# Altium project ODrive_2motor.PrjPcb
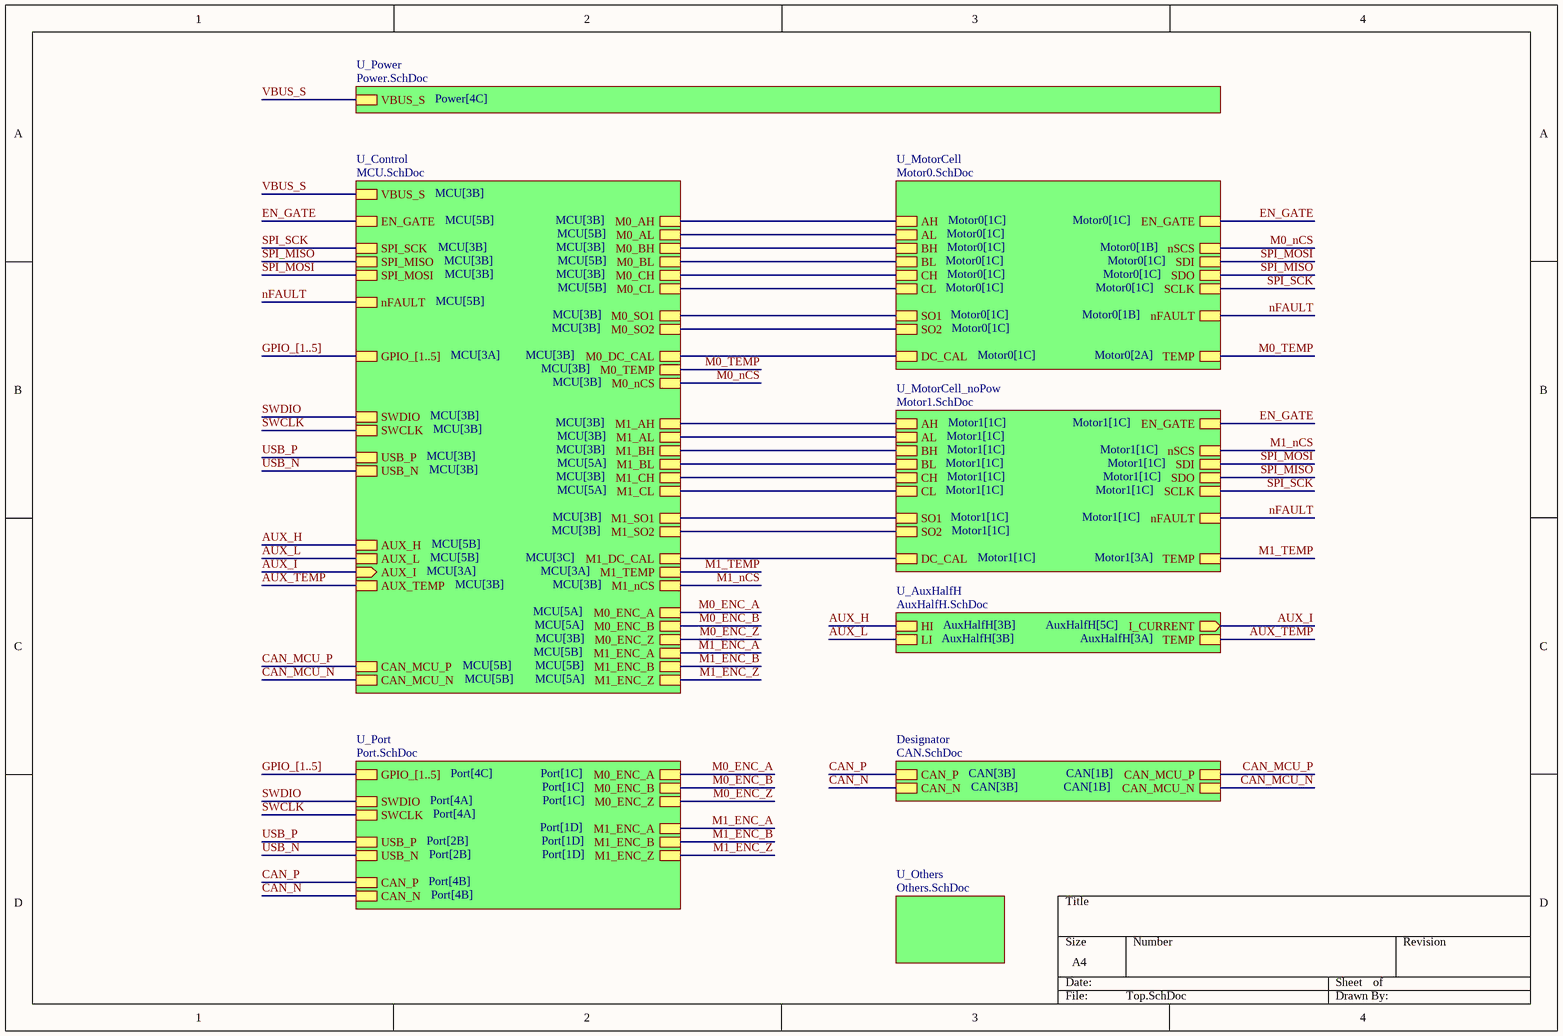
[diagram p0: Top.SchDoc]
9 sheets, 198 parts. Net scope: hierarchical (ports join the sheet entries above them; power ports are global).
Board file: Odrive.PcbDoc
Sheets:
  Top.SchDoc
    U_AuxHalfH = AuxHalfH.SchDoc
    U_Control = MCU.SchDoc
    U_MotorCell = Motor0.SchDoc
    U_MotorCell_noPow = Motor1.SchDoc
    U_Power = Power.SchDoc
    U_Port = Port.SchDoc
    Designator = CAN.SchDoc
    U_Others = Others.SchDoc

## Sheet Top.SchDoc
size A4

### Sub-sheets
Designator = CAN.SchDoc: CAN_P, CAN_N, CAN_MCU_P, CAN_MCU_N
U_AuxHalfH = AuxHalfH.SchDoc: HI, LI, I_CURRENT (out), TEMP
U_Control = MCU.SchDoc: VBUS_S, M1_AL, M0_AH, M0_BH, M0_CH, M0_SO1, M0_SO2, M1_SO2, M1_SO1, AUX_TEMP, M0_TEMP, M1_AH, M1_BH, M1_CH, M0_DC_CAL, M1_BL, M1_CL, EN_GATE, AUX_L, AUX_H, M0_AL, M0_BL, M0_CL, nFAULT, M1_DC_CAL, M0_nCS, M1_nCS, AUX_I (in), M1_TEMP, SPI_SCK, SPI_MISO, SPI_MOSI, GPIO_[1..5], SWDIO, SWCLK, USB_N, USB_P, M1_ENC_Z, M0_ENC_A, M0_ENC_B, M1_ENC_A, M1_ENC_B, M0_ENC_Z, CAN_MCU_P, CAN_MCU_N
U_MotorCell = Motor0.SchDoc: nFAULT, EN_GATE, AH, AL, BH, BL, CH, CL, DC_CAL, SDI, SDO, SCLK, nSCS, SO1, SO2, TEMP
U_MotorCell_noPow = Motor1.SchDoc: nFAULT, EN_GATE, AH, AL, BH, BL, CH, CL, DC_CAL, SDI, SDO, SCLK, nSCS, TEMP, SO1, SO2
U_Others = Others.SchDoc: no entries
U_Port = Port.SchDoc: GPIO_[1..5], SWDIO, SWCLK, CAN_P, CAN_N, M1_ENC_A, M1_ENC_B, M1_ENC_Z, M0_ENC_A, M0_ENC_B, M0_ENC_Z, USB_N, USB_P
U_Power = Power.SchDoc: VBUS_S

### Nets
AUX_H: sheet U_AuxHalfH/HI, sheet U_Control/AUX_H
AUX_I: sheet U_AuxHalfH/I_CURRENT, sheet U_Control/AUX_I
AUX_L: sheet U_AuxHalfH/LI, sheet U_Control/AUX_L
AUX_TEMP: sheet U_AuxHalfH/TEMP, sheet U_Control/AUX_TEMP
CAN_MCU_N: sheet U_Control/CAN_MCU_N, sheet Designator/CAN_MCU_N
CAN_MCU_P: sheet U_Control/CAN_MCU_P, sheet Designator/CAN_MCU_P
CAN_N: sheet U_Port/CAN_N, sheet Designator/CAN_N
CAN_P: sheet U_Port/CAN_P, sheet Designator/CAN_P
EN_GATE: sheet U_Control/EN_GATE, sheet U_MotorCell/EN_GATE, sheet U_MotorCell_noPow/EN_GATE
M0_ENC_A: sheet U_Control/M0_ENC_A, sheet U_Port/M0_ENC_A
M0_ENC_B: sheet U_Control/M0_ENC_B, sheet U_Port/M0_ENC_B
M0_ENC_Z: sheet U_Control/M0_ENC_Z, sheet U_Port/M0_ENC_Z
M0_nCS: sheet U_Control/M0_nCS, sheet U_MotorCell/nSCS
M0_TEMP: sheet U_Control/M0_TEMP, sheet U_MotorCell/TEMP
M1_ENC_A: sheet U_Control/M1_ENC_A, sheet U_Port/M1_ENC_A
M1_ENC_B: sheet U_Control/M1_ENC_B, sheet U_Port/M1_ENC_B
M1_ENC_Z: sheet U_Control/M1_ENC_Z, sheet U_Port/M1_ENC_Z
M1_nCS: sheet U_Control/M1_nCS, sheet U_MotorCell_noPow/nSCS
M1_TEMP: sheet U_Control/M1_TEMP, sheet U_MotorCell_noPow/TEMP
nFAULT: sheet U_Control/nFAULT, sheet U_MotorCell/nFAULT, sheet U_MotorCell_noPow/nFAULT
SPI_MISO: sheet U_Control/SPI_MISO, sheet U_MotorCell/SDO, sheet U_MotorCell_noPow/SDO
SPI_MOSI: sheet U_Control/SPI_MOSI, sheet U_MotorCell/SDI, sheet U_MotorCell_noPow/SDI
SPI_SCK: sheet U_Control/SPI_SCK, sheet U_MotorCell/SCLK, sheet U_MotorCell_noPow/SCLK
SWCLK: sheet U_Control/SWCLK, sheet U_Port/SWCLK
SWDIO: sheet U_Control/SWDIO, sheet U_Port/SWDIO
USB_N: sheet U_Control/USB_N, sheet U_Port/USB_N
USB_P: sheet U_Control/USB_P, sheet U_Port/USB_P
VBUS_S: sheet U_Control/VBUS_S, sheet U_Power/VBUS_S
NetC47_2: sheet U_Control/M0_SO1, sheet U_MotorCell/SO1
NetC48_2: sheet U_Control/M0_SO2, sheet U_MotorCell/SO2
NetC62_2: sheet U_Control/M1_SO1, sheet U_MotorCell_noPow/SO1
NetC63_2: sheet U_Control/M1_SO2, sheet U_MotorCell_noPow/SO2
NetU4_4: sheet U_Control/M1_DC_CAL, sheet U_MotorCell_noPow/DC_CAL
NetU4_23: sheet U_Control/M1_AL, sheet U_MotorCell_noPow/AL
NetU4_26: sheet U_Control/M1_BL, sheet U_MotorCell_noPow/BL
NetU4_27: sheet U_Control/M1_CL, sheet U_MotorCell_noPow/CL
NetU4_34: sheet U_Control/M0_AL, sheet U_MotorCell/AL
NetU4_35: sheet U_Control/M0_BL, sheet U_MotorCell/BL
NetU4_36: sheet U_Control/M0_CL, sheet U_MotorCell/CL
NetU4_37: sheet U_Control/M1_AH, sheet U_MotorCell_noPow/AH
NetU4_38: sheet U_Control/M1_BH, sheet U_MotorCell_noPow/BH
NetU4_39: sheet U_Control/M1_CH, sheet U_MotorCell_noPow/CH
NetU4_40: sheet U_Control/M0_DC_CAL, sheet U_MotorCell/DC_CAL
NetU4_41: sheet U_Control/M0_AH, sheet U_MotorCell/AH
NetU4_42: sheet U_Control/M0_BH, sheet U_MotorCell/BH
NetU4_43: sheet U_Control/M0_CH, sheet U_MotorCell/CH

### Buses and harness runs
bus GPIO_[1..5] = sheet U_Control/GPIO_[1..5]
bus GPIO_[1..5] = sheet U_Port/GPIO_[1..5]

## Sheet AuxHalfH.SchDoc
size A3; DocumentNumber: 5; SheetNumber: 5; SheetTotal: 5
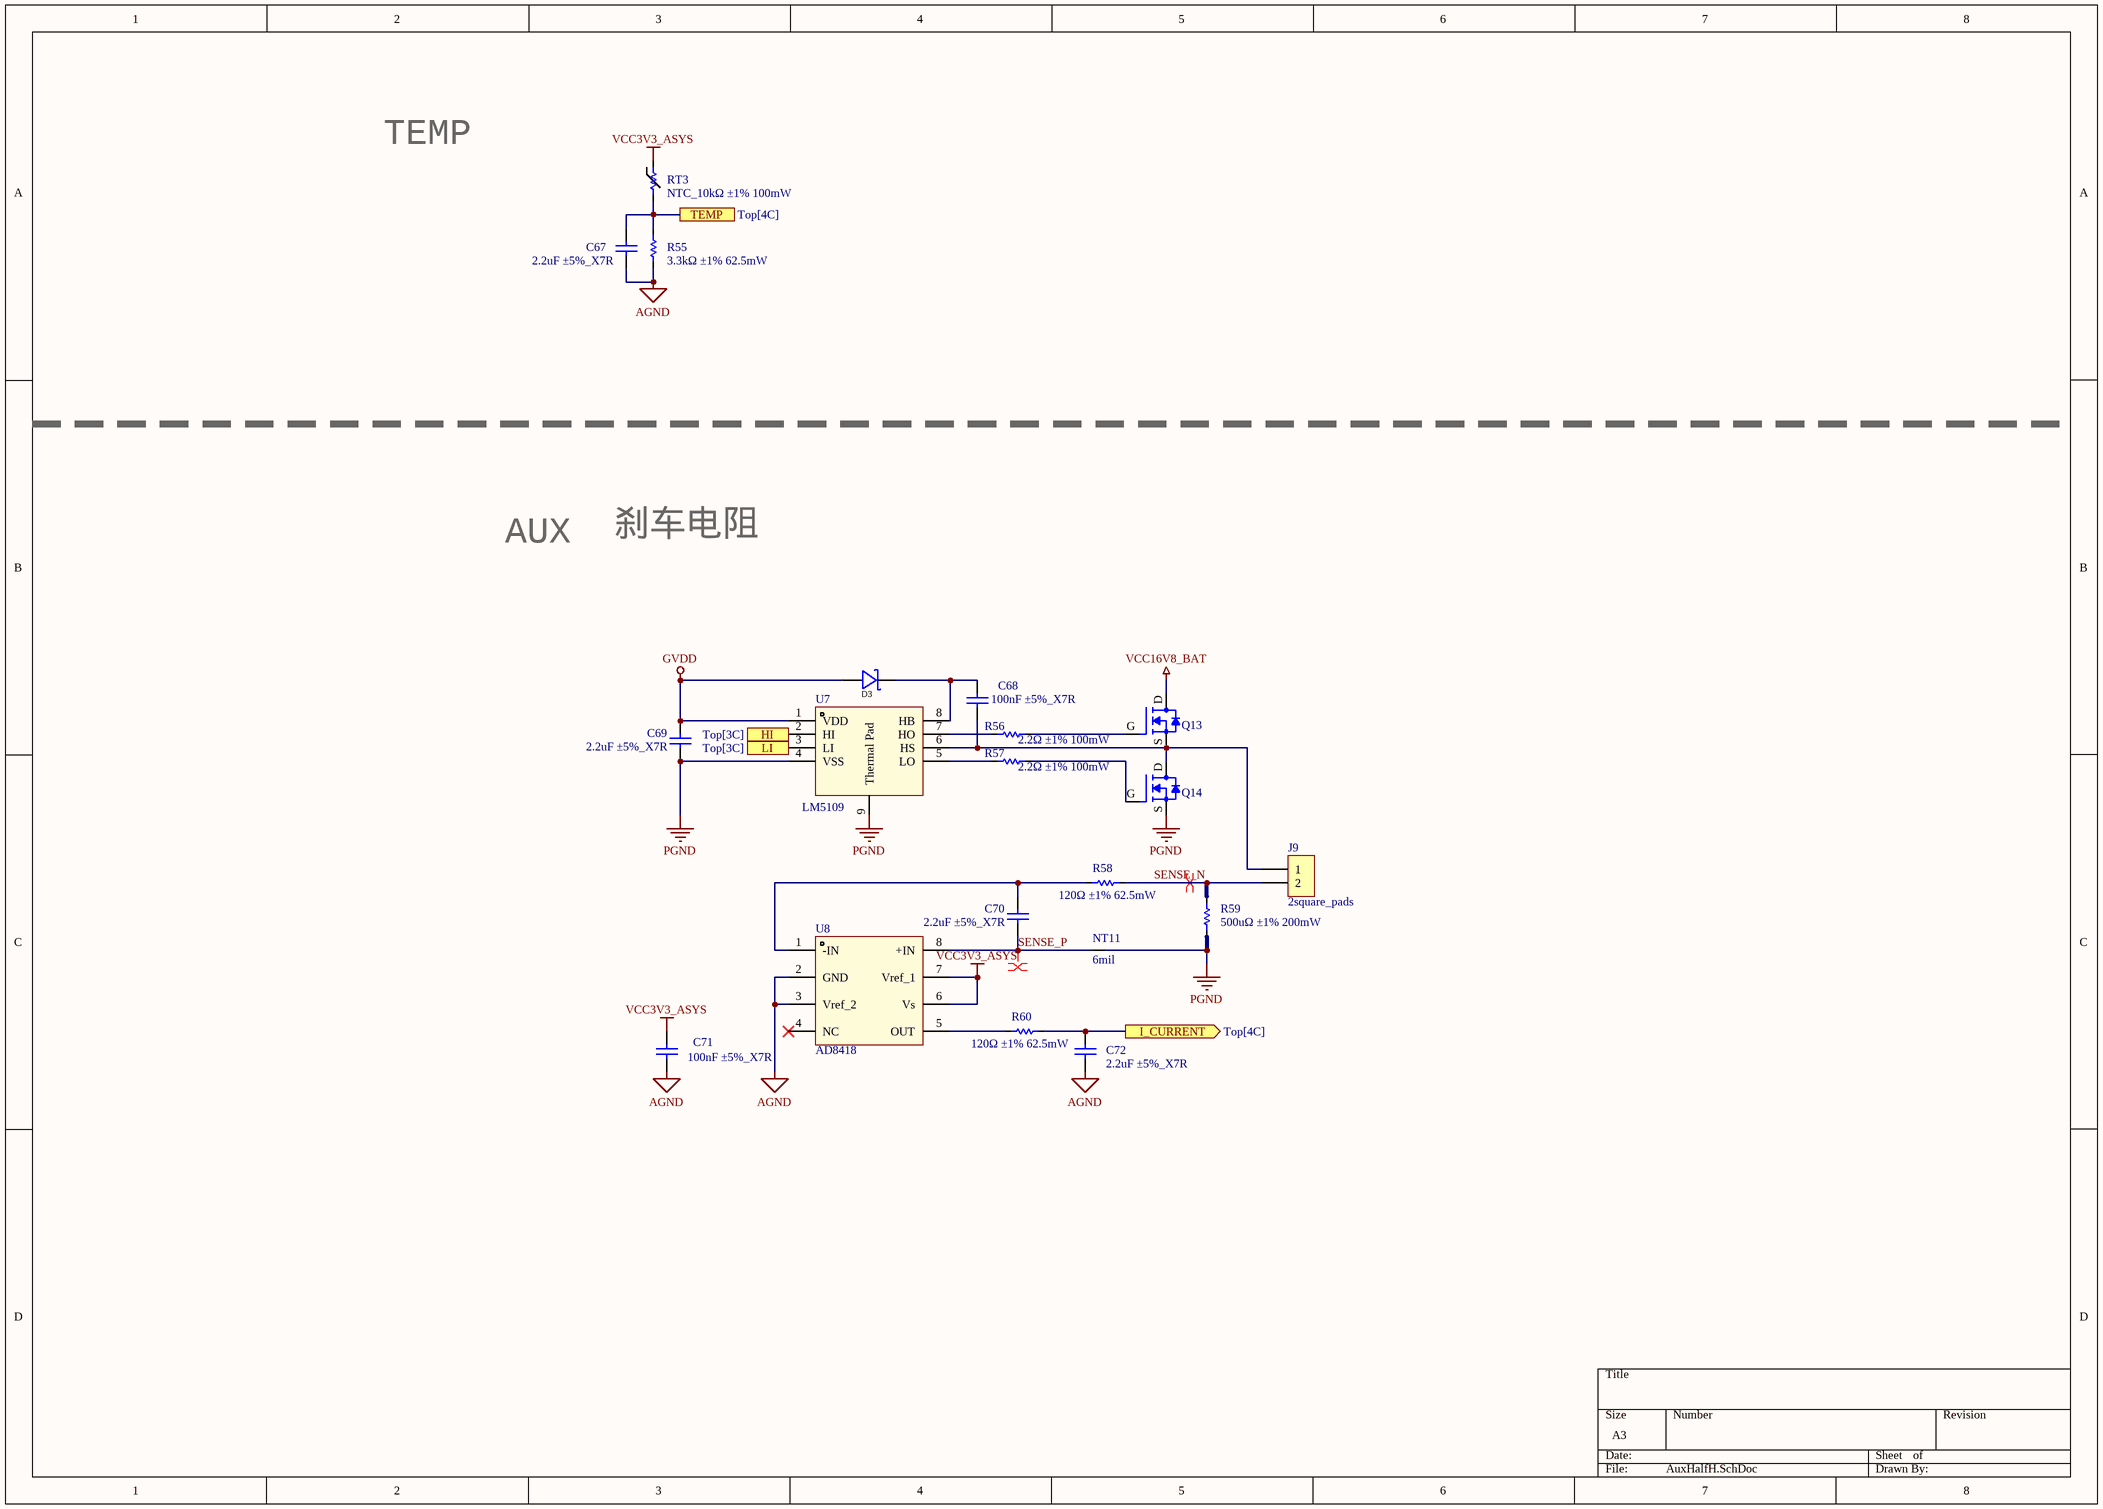
[diagram p1: AuxHalfH.SchDoc]

### Parts
C67  2.2uF ±5%_X7R  [WCAP-CSGP_0402_L1W0.5H0.5]
C68  100nF ±5%_X7R  [WCAP-CSGP_0603_L1.6W0.8H0.8_Reflow]
C69  2.2uF ±5%_X7R  [WCAP-CSGP_0603_L1.6W0.8H0.8_Reflow]
C70  2.2uF ±5%_X7R  [WCAP-CSGP_0402_L1W0.5H0.5]
C71  100nF ±5%_X7R  [WCAP-CSGP_0402_L1W0.5H0.5]
C72  2.2uF ±5%_X7R  [WCAP-CSGP_0402_L1W0.5H0.5]
D3  B340A-13-F  [SMA_L4.4-W2.6-LS5.0-RD]  (value not drawn)
J9  2square_pads  [2pads_square]
NT11  6mil  [NETTIE_6mil]  (net tie, no BOM)
Q13  BSC027N04LSG  [NRVTS10100EMFST1G]  (value not drawn)
Q14  BSC027N04LSG  [NRVTS10100EMFST1G]  (value not drawn)
R55  3.3kΩ ±1% 62.5mW  [WRIS-KSKE_0402]
R56  2.2Ω ±1% 100mW  [WRIS-KSKE_0402]
R57  2.2Ω ±1% 100mW  [WRIS-KSKE_0402]
R58  120Ω ±1% 62.5mW  [WRIS-KSKE_0402]
R59  500uΩ ±1% 200mW  [WRIS-KSKE_2512]
R60  120Ω ±1% 62.5mW  [WRIS-KSKE_0402]
RT3  NTC_10kΩ ±1% 100mW  [WRIS-KSKE_0402]
U7  LM5109  [SON80P400X80_HS-9N]
U8  AD8418  [MSOP-8_L3.0-W3.0-P0.65-LS5.0-BL]

### Ports
HI (see Top[3C]), I_CURRENT (out, see Top[4C]), LI (see Top[3C]), TEMP (see Top[4C])

### Nets
AGND: C67.1 C71.1 C72.1 R55.1 U8.2(GND) U8.3(Vref_2)
GVDD: C69.2 D3.2(A) U7.1(VDD)
PGND: C69.1 NT11.1 Q14.S R59.2 U7.4(VSS) U7.9(Thermal_Pad)
VCC3V3_ASYS: C71.2 RT3.1 U8.6(Vs) U8.7(Vref_1)
VCC16V8_BAT: Q13.D
AUX_H: U7.2(HI) ; port HI
AUX_I: C72.2 R60.1 ; port I_CURRENT
AUX_L: U7.3(LI) ; port LI
AUX_TEMP: C67.2 R55.2 RT3.2 ; port TEMP
SENSE_N: J9.2 R58.1 R59.1
SENSE_P: C70.1 NT11.2 U8.8(+IN)
NetC68_1: C68.1 J9.1 Q13.S Q14.D U7.6(HS)
NetC68_2: C68.2 D3.1(K) U7.8(HB)
NetC70_2: C70.2 R58.2 U8.1(-IN)
NetQ13_G: Q13.G R56.1
NetQ14_G: Q14.G R57.1
NetR56_2: R56.2 U7.7(HO)
NetR57_2: R57.2 U7.5(LO)
NetR60_2: R60.2 U8.5(OUT)

Not connected (* = marked no-connect by the designer): U8 4(NC)*

### Layout directives
differential pair: SENSE_N, SENSE_P

### Notes on the sheet
- TEMP
- AUX
- 刹车电阻

### Library data of the parts
C67-C72 = Cap: Capacitor; Published: 8-Jun-2000; LatestRevisionDate: 17-Jul-2002; LatestRevisionNote: Re-released for DXP Platform.; PackageReference: RAD-0.3; Publisher: Altium Limited; PackageDescription: Radial Cap, Thru-Hole; 2 Leads; 0.3 in Pin Spacing
D3 = Diode_Schottky: 直流反向耐压(Vr):40V;平均整流电流(Io):3A;正向压降(Vf):500mV@3A;; Manufacturer: DIODES(美台); Add into BOM: yes; Reverse Voltage (Vr): 40V; Average Rectified Current (Io): 3A; Name: B340A-13-F; Symbol: B340A-13-F; Device: B340A-13-F; LCSC Part Name: 40V 3A 500mV@3A; Supplier Part: C85098; Manufacturer Part: B340A-13-F; Supplier Footprint: SMA(DO-214AC); JLCPCB Part Class: 扩展库; Datasheet: https://atta.szlcsc.com/upload/public/pdf/source/20171023/C134454_15087453575121052549.pdf; Supplier: LCSC; Convert to PCB: yes; Forward Voltage (Vf@If): 500mV@3A
NT11 = NETTIE
Q13 Q14 = MOSFET-N: MOSFET – Power, Single, / N-Channel, PG-TDSON-8 / SuperSO8 5x6 / 40 V, 139 A; Manufacturer: ON Semiconductor; Manufacturer Part Number: NTMFS4935NT1G; Drain to Source Voltage (Vdss): 30V; Current - Continuous Drain (Id) @ 25°C: 13A (Ta), 93A (Tc); Drive Voltage (Max Rds On,  Min Rds On): 4.5V, 10V; Vgs(th) (Max) @ Id: 2.2V @ 250µA; Gate Charge (Qg) (Max) @ Vgs: 49.4nC @ 10V; Input Capacitance (Ciss) (Max) @ Vds: 4850pF @ 15V; Vgs (Max): ±20V; Power Dissipation (Max): 930mW (Ta), 48W (Tc); Rds On (Max) @ Id, Vgs: 3.2 mOhm @ 30A, 10V; Supplier 1: Digi-Key; Supplier Part Number 1: NTMFS4935NT1GOSCT-ND; RoHS: RoHS Compliant; Category: Discrete Semiconductor Products; Stock 1: 932; Pricing 1: 1=0.61, 10=0.541, 100=0.4145, 500=0.3277 (USD); Packaging: Cut Tape (CT); Part Status: Active; FET Type: N-Channel; Technology: MOSFET (Metal Oxide); FET Feature: -; Operating Temperature: -55°C ~ 150°C (TJ); Mounting Type: Surface Mount; Supplier Device Package: 5-DFN (5x6) (8-SOFL); Package / Case: 8-PowerTDFN, 5 Leads; ComponentLink1URL: http://www.onsemi.com/pub_link/Collateral/NTMFS4935N-D.PDF; ComponentLink1Description: http://www.onsemi.com/pub_link/Collateral/NTMFS4935N-D.PDF
R55-R60 = Res: Resistor; Published: 8-Jun-2000; LatestRevisionDate: 17-Jul-2002; LatestRevisionNote: Re-released for DXP Platform.; PackageReference: AXIAL-0.3; Publisher: Altium Limited; PackageDescription: Axial Device, Thru-Hole; 2 Leads; 0.3 in Pin Spacing
RT3 = TEMP RES: THERMISTOR 10K OHM NTC 0402 SMD
U7 = LM5109: DRIVER, MOSFET, HALF BRIDGE, WSON-8, 1A; Supplier 1: Farnell; Supplier Part Number 1: 2400642RL; Supplier 2: Farnell; Supplier Part Number 2: 2400642; Supplier 3: Farnell; Supplier Part Number 3: 2382850
U8 = AD8418WBRZ: ANALOG DEVICES Current Sense Amplifier, Bidirectional, 1, 130 µA, NSOIC

## Sheet MCU.SchDoc
size A3; DocumentNumber: 3; SheetNumber: 1; SheetTotal: 5
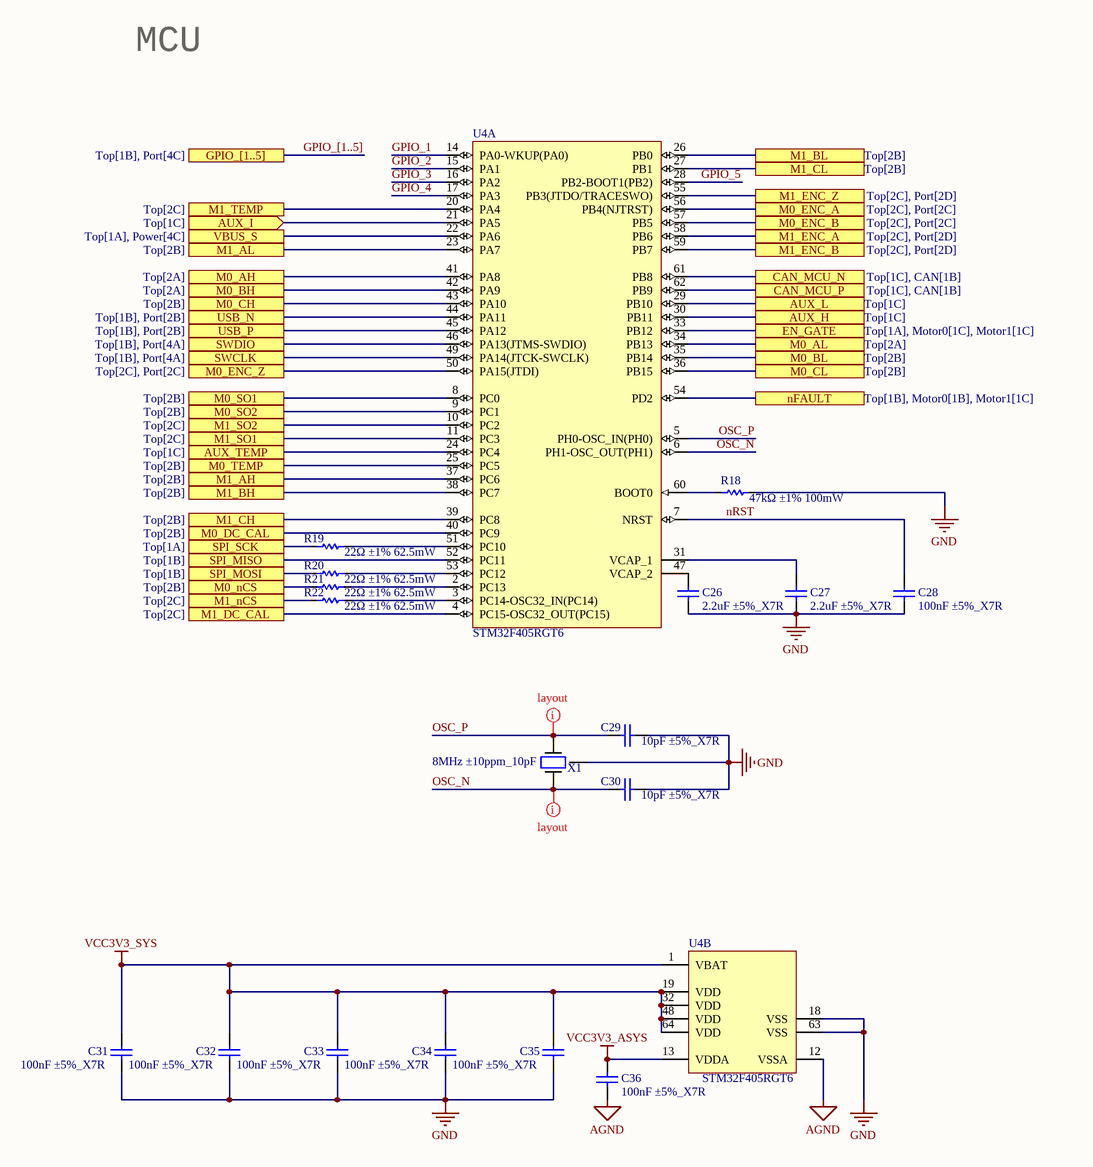
[diagram p2: MCU.SchDoc]

### Parts
C26  2.2uF ±5%_X7R  [WCAP-CSGP_0603_L1.6W0.8H0.8_Reflow]
C27  2.2uF ±5%_X7R  [WCAP-CSGP_0603_L1.6W0.8H0.8_Reflow]
C28  100nF ±5%_X7R  [WCAP-CSGP_0402_L1W0.5H0.5]
C29  10pF ±5%_X7R  [WCAP-CSGP_0402_L1W0.5H0.5]
C30  10pF ±5%_X7R  [WCAP-CSGP_0402_L1W0.5H0.5]
C31  100nF ±5%_X7R  [WCAP-CSGP_0402_L1W0.5H0.5]
C32  100nF ±5%_X7R  [WCAP-CSGP_0402_L1W0.5H0.5]
C33  100nF ±5%_X7R  [WCAP-CSGP_0402_L1W0.5H0.5]
C34  100nF ±5%_X7R  [WCAP-CSGP_0402_L1W0.5H0.5]
C35  100nF ±5%_X7R  [WCAP-CSGP_0402_L1W0.5H0.5]
C36  100nF ±5%_X7R  [WCAP-CSGP_0402_L1W0.5H0.5]
R18  47kΩ ±1% 100mW  [WRIS-KSKE_0402]
R19  22Ω ±1% 62.5mW  [WRIS-KSKE_0402]
R20  22Ω ±1% 62.5mW  [WRIS-KSKE_0402]
R21  22Ω ±1% 62.5mW  [WRIS-KSKE_0402]
R22  22Ω ±1% 62.5mW  [WRIS-KSKE_0402]
U4  STM32F405RGT6  [STM-LQFP64_N]  (parts A,B of 2)
X1  8MHz ±10ppm_10pF  [CRYSTAL_3225]

### Ports
AUX_H (see Top[1C]), AUX_I (in, see Top[1C]), AUX_L (see Top[1C]), AUX_TEMP (see Top[1C]), CAN_MCU_N (see Top[1C], CAN[1B]), CAN_MCU_P (see Top[1C], CAN[1B]), EN_GATE (see Top[1A], Motor0[1C], Motor1[1C]), GPIO_[1..5] (see Top[1B], Port[4C]), M0_AH (see Top[2A]), M0_AL (see Top[2A]), M0_BH (see Top[2A]), M0_BL (see Top[2B]), M0_CH (see Top[2B]), M0_CL (see Top[2B]), M0_DC_CAL (see Top[2B]), M0_ENC_A (see Top[2C], Port[2C]), M0_ENC_B (see Top[2C], Port[2C]), M0_ENC_Z (see Top[2C], Port[2C]), M0_nCS (see Top[2B]), M0_SO1 (see Top[2B]), M0_SO2 (see Top[2B]), M0_TEMP (see Top[2B]), M1_AH (see Top[2B]), M1_AL (see Top[2B]), M1_BH (see Top[2B]), M1_BL (see Top[2B]), M1_CH (see Top[2B]), M1_CL (see Top[2B]), M1_DC_CAL (see Top[2C]), M1_ENC_A (see Top[2C], Port[2D]), M1_ENC_B (see Top[2C], Port[2D]), M1_ENC_Z (see Top[2C], Port[2D]), M1_nCS (see Top[2C]), M1_SO1 (see Top[2C]), M1_SO2 (see Top[2C]), M1_TEMP (see Top[2C]), nFAULT (see Top[1B], Motor0[1B], Motor1[1C]), SPI_MISO (see Top[1B]), SPI_MOSI (see Top[1B]), SPI_SCK (see Top[1A]), SWCLK (see Top[1B], Port[4A]), SWDIO (see Top[1B], Port[4A]), USB_N (see Top[1B], Port[2B]), USB_P (see Top[1B], Port[2B]), VBUS_S (see Top[1A], Power[4C])

### Nets
AGND: C36.1 U4.12(VSSA)
GND: C26.1 C27.1 C28.1 C29.2 C30.2 C31.1 C32.1 C33.1 C34.1 C35.1 R18.2 U4.18(VSS) U4.63(VSS) X1.G
VCC3V3_ASYS: C36.2 U4.13(VDDA)
VCC3V3_SYS: C31.2 C32.2 C33.2 C34.2 C35.2 U4.1(VBAT) U4.19(VDD) U4.32(VDD) U4.48(VDD) U4.64(VDD)
AUX_H: U4.30(PB11) ; port AUX_H
AUX_I: U4.21(PA5) ; port AUX_I
AUX_L: U4.29(PB10) ; port AUX_L
AUX_TEMP: U4.24(PC4) ; port AUX_TEMP
CAN_MCU_N: U4.61(PB8) ; port CAN_MCU_N
CAN_MCU_P: U4.62(PB9) ; port CAN_MCU_P
EN_GATE: U4.33(PB12) ; port EN_GATE
GPIO_1: U4.14(PA0-WKUP(PA0))
GPIO_2: U4.15(PA1)
GPIO_3: U4.16(PA2)
GPIO_4: U4.17(PA3)
GPIO_5: U4.28(PB2-BOOT1(PB2))
M0_ENC_A: U4.56(PB4(NJTRST)) ; port M0_ENC_A
M0_ENC_B: U4.57(PB5) ; port M0_ENC_B
M0_ENC_Z: U4.50(PA15(JTDI)) ; port M0_ENC_Z
M0_nCS: R21.1 ; port M0_nCS
M0_TEMP: U4.25(PC5) ; port M0_TEMP
M1_ENC_A: U4.58(PB6) ; port M1_ENC_A
M1_ENC_B: U4.59(PB7) ; port M1_ENC_B
M1_ENC_Z: U4.55(PB3(JTDO/TRACESWO)) ; port M1_ENC_Z
M1_nCS: R22.1 ; port M1_nCS
M1_TEMP: U4.20(PA4) ; port M1_TEMP
nFAULT: U4.54(PD2) ; port nFAULT
nRST: C28.2 U4.7(NRST)
OSC_N: C30.1 U4.6(PH1-OSC_OUT(PH1)) X1.1
OSC_P: C29.1 U4.5(PH0-OSC_IN(PH0)) X1.3
SPI_MISO: U4.52(PC11) ; port SPI_MISO
SPI_MOSI: R20.1 ; port SPI_MOSI
SPI_SCK: R19.1 ; port SPI_SCK
SWCLK: U4.49(PA14(JTCK-SWCLK)) ; port SWCLK
SWDIO: U4.46(PA13(JTMS-SWDIO)) ; port SWDIO
USB_N: U4.44(PA11) ; port USB_N
USB_P: U4.45(PA12) ; port USB_P
VBUS_S: U4.22(PA6) ; port VBUS_S
NetC26_2: C26.2 U4.47(VCAP_2)
NetC27_2: C27.2 U4.31(VCAP_1)
NetC47_2: U4.8(PC0) ; port M0_SO1
NetC48_2: U4.9(PC1) ; port M0_SO2
NetC62_2: U4.11(PC3) ; port M1_SO1
NetC63_2: U4.10(PC2) ; port M1_SO2
NetR18_1: R18.1 U4.60(BOOT0)
NetR19_2: R19.2 U4.51(PC10)
NetR20_2: R20.2 U4.53(PC12)
NetR21_2: R21.2 U4.2(PC13)
NetR22_2: R22.2 U4.3(PC14-OSC32_IN(PC14))
NetU4_4: U4.4(PC15-OSC32_OUT(PC15)) ; port M1_DC_CAL
NetU4_23: U4.23(PA7) ; port M1_AL
NetU4_26: U4.26(PB0) ; port M1_BL
NetU4_27: U4.27(PB1) ; port M1_CL
NetU4_34: U4.34(PB13) ; port M0_AL
NetU4_35: U4.35(PB14) ; port M0_BL
NetU4_36: U4.36(PB15) ; port M0_CL
NetU4_37: U4.37(PC6) ; port M1_AH
NetU4_38: U4.38(PC7) ; port M1_BH
NetU4_39: U4.39(PC8) ; port M1_CH
NetU4_40: U4.40(PC9) ; port M0_DC_CAL
NetU4_41: U4.41(PA8) ; port M0_AH
NetU4_42: U4.42(PA9) ; port M0_BH
NetU4_43: U4.43(PA10) ; port M0_CH

### Buses and harness runs
bus GPIO_[1..5] = port GPIO_[1..5]

### Layout directives
mark named layout: OSC_N, OSC_P

### Notes on the sheet
- MCU

### Library data of the parts
C26-C36 = Cap: Capacitor; Published: 8-Jun-2000; LatestRevisionDate: 17-Jul-2002; LatestRevisionNote: Re-released for DXP Platform.; PackageReference: RAD-0.3; Publisher: Altium Limited; PackageDescription: Radial Cap, Thru-Hole; 2 Leads; 0.3 in Pin Spacing
R18-R22 = Res: Resistor; Published: 8-Jun-2000; LatestRevisionDate: 17-Jul-2002; LatestRevisionNote: Re-released for DXP Platform.; PackageReference: AXIAL-0.3; Publisher: Altium Limited; PackageDescription: Axial Device, Thru-Hole; 2 Leads; 0.3 in Pin Spacing
U4 = STM32F405RGT6: ARM Cortex-M4 32-bit MCU+FPU, 210 DMIPS, 1024 kB Flash, 192 kB Internal RAM, 51 I/Os, 64-pin LQFP, -40 to 85 degC, Tray; Manufacturer: STMicroelectronics; D/A Converter: 2x12-bit; FLASH Size (Prog) (kB): 1024; I/Os (High Current): 51; Internal RAM Size (kB): 192; Operating Frequency(F) (Processor speed) (MHz): 168; Supply Voltage(Vcc) max (V): 3.6; Supply Voltage(Vcc) min (V): 1.8; DatasheetVersion: Rev. 4; PackageVersion: Rev. 4, 06/2013; PackageReference: LQFP64; PackageDescription: 64-Pin Low Profile Quad Flat Package, 10 x 10 mm Body, 0.5 mm Pitch; Supplier 1: Digi-Key; Supplier Part Number 1: 497-11767-ND; Supplier 2: Farnell; Supplier Part Number 2: 2064363; Supplier 3: Newark; Supplier Part Number 3: 73T2329; Supplier 4: Mouser; Supplier Part Number 4: 511-STM32F405RGT6; Core: ARM Cortex-M4; Packing: Tray; Mounting Technology: Surface Mount; PartNumber: STM32F405RGT6; ComponentLink1Description: Manufacturer URL; ComponentLink1URL: http://www.st.com/web/en/home.html; ComponentLink2Description: Datasheet; ComponentLink2URL: http://www.st.com/st-web-ui/static/active/en/resource/technical/document/datasheet/DM00037051.pdf; ComponentLink3Description: Package Specification; ComponentLink3URL: http://www.st.com/st-web-ui/static/active/en/resource/technical/document/datasheet/DM00037051.pdf
X1 = CRYSTAL: Crystal 8MHz ±10ppm 10pF 200 Ohm -10°C ~ 60°C Surface Mount 4-SMD, No Lead (DFN, LCC); Manufacturer: Abracon LLC; Manufacturer Part Number: ABM3B-8.000MHZ-10-1-U-T; Operating Mode: Fundamental; Supplier 1: Digi-Key; Supplier Part Number 1: 535-9721-1-ND; RoHS: RoHS Compliant; Category: Crystals, Oscillators, Resonators; Stock: 35437; Pricing 1: 1=0.69, 10=0.578, 50=0.5198, 100=0.462, 500=0.4389 (USD); Packaging: Cut Tape (CT); Part Status: Active; Type: MHz Crystal; Frequency Stability: ±10ppm; Frequency Tolerance: ±10ppm; Load Capacitance: 10pF; Operating Temperature: -10°C ~ 60°C; Ratings: -; Mounting Type: Surface Mount; Package / Case: 4-SMD, No Lead; Size / Dimension: 0.197" L x 0.126" W (5.00mm x 3.20mm); Height - Seated (Max): 0.043" (1.10mm); ComponentLink1URL: http://www.abracon.com/Resonators/abm3b.pdf; ComponentLink1Description: http://www.abracon.com/Resonators/abm3b.pdf; Supplier 2: Digi-Key; Supplier Part Number 2: 535-9721-2-ND; Pricing 2: 1000=0.336, 3000=0.315, 5000=0.3045, 10000=0.294 (USD)

## Sheet Motor0.SchDoc
size A3; DocumentNumber: 1; SheetNumber: 3; SheetTotal: 5; SPICEModelCache: <root> / <DocumentId>HIQXUUEP</DocumentId> / </root>
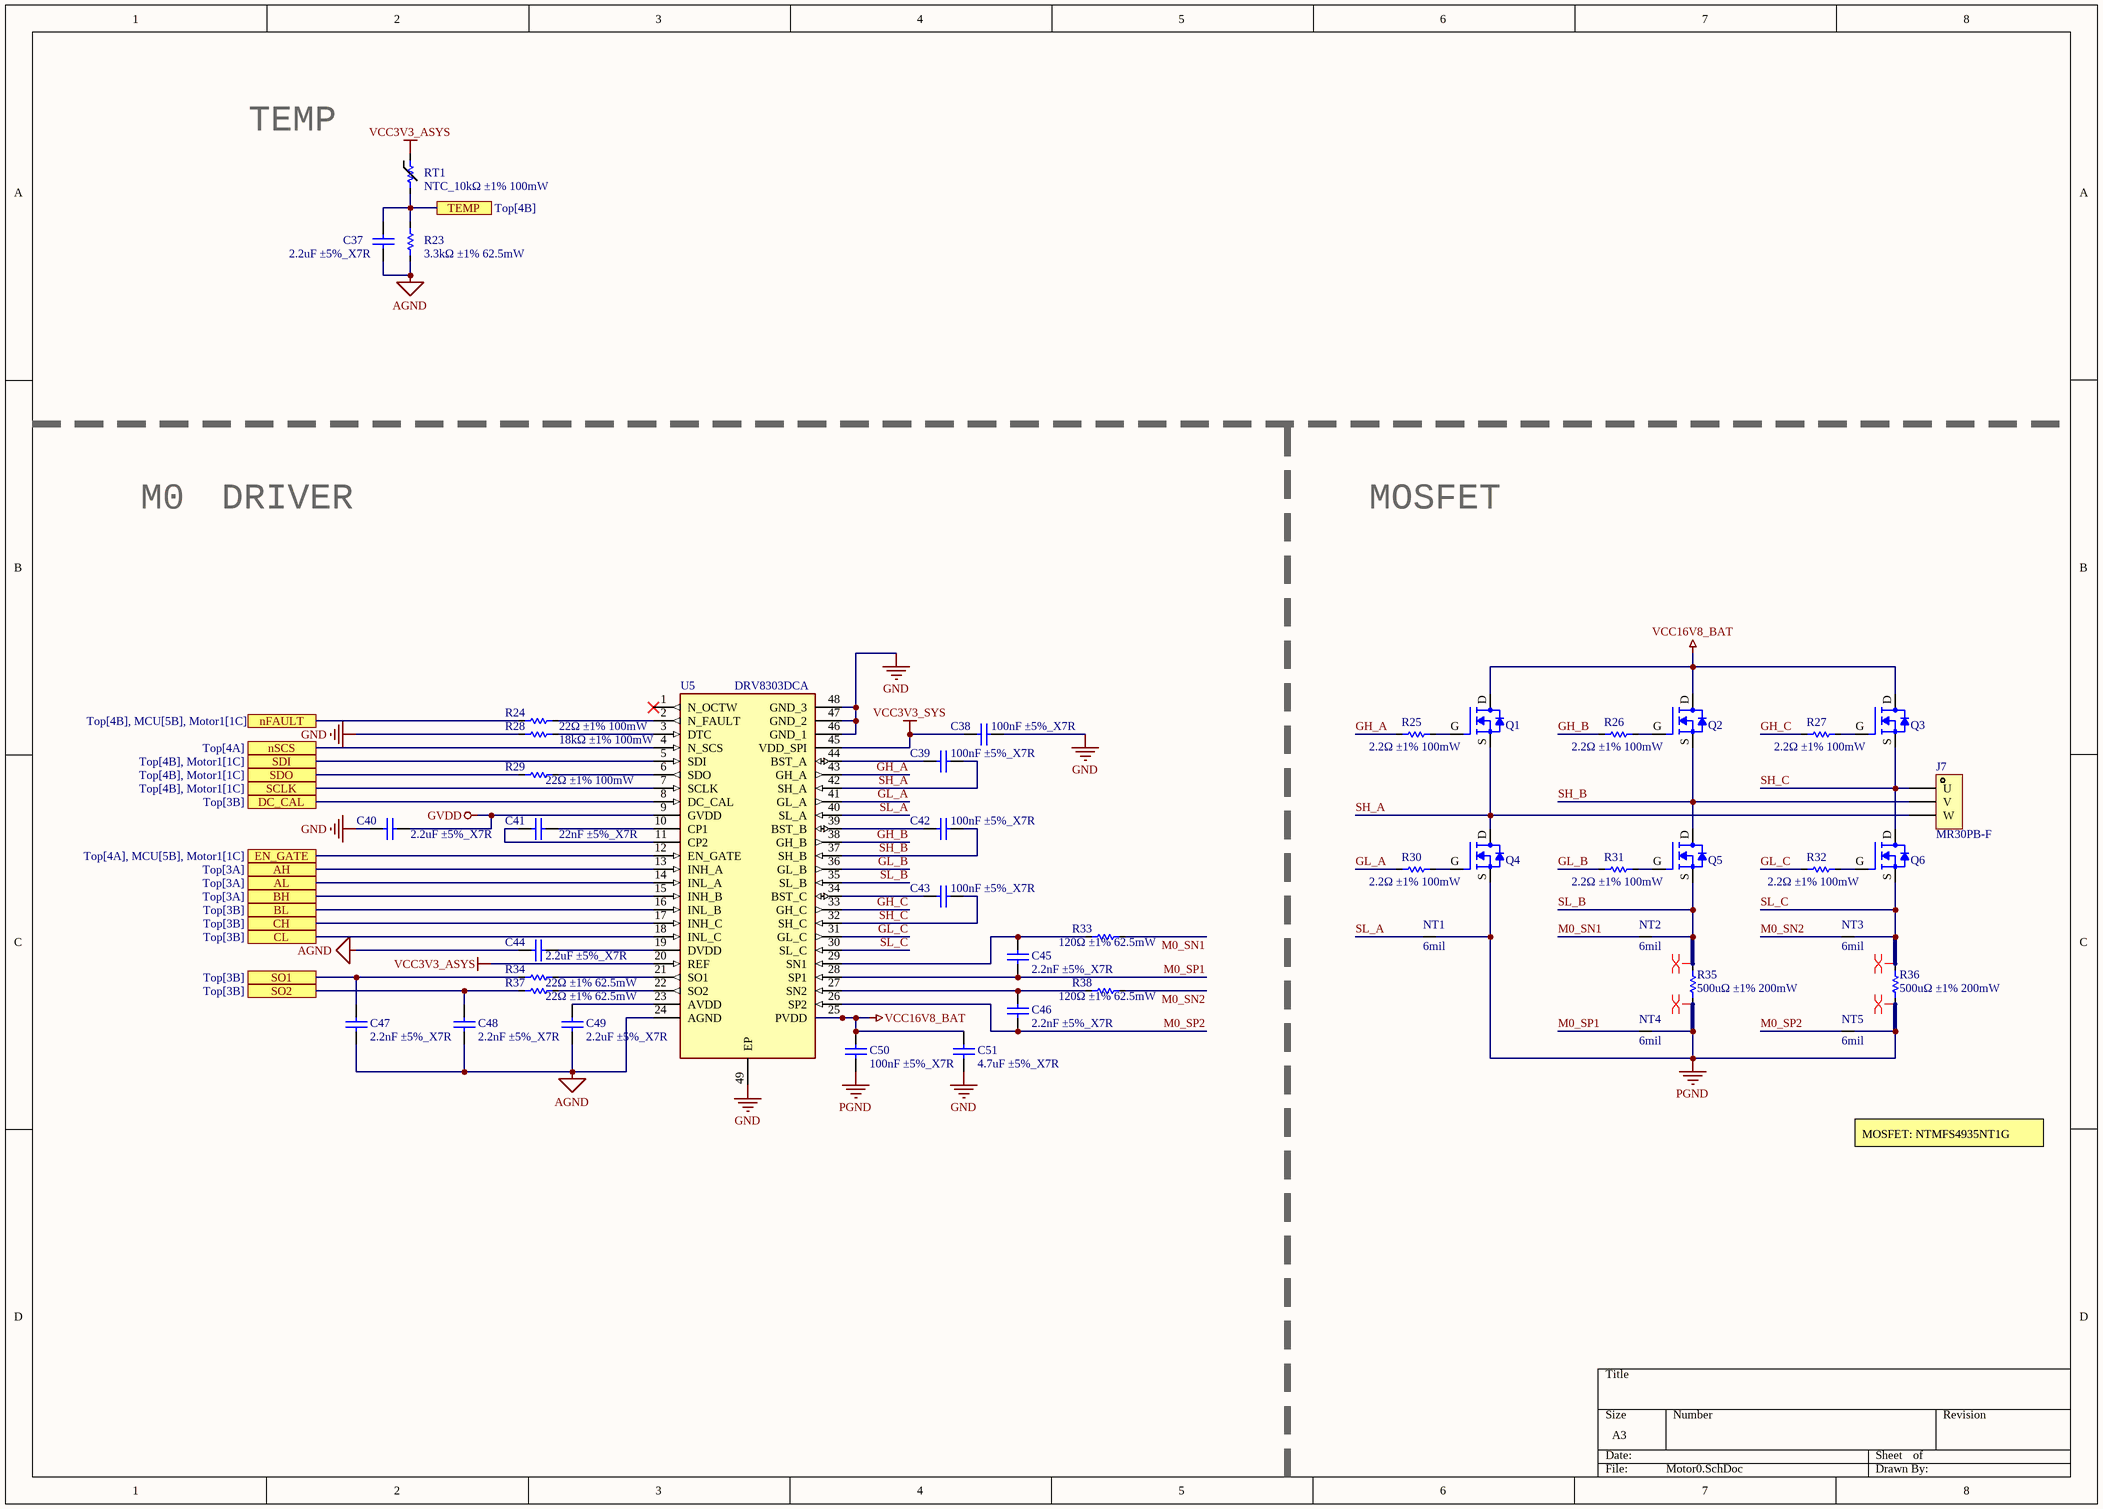
[diagram p3: Motor0.SchDoc]

### Parts
C37  2.2uF ±5%_X7R  [WCAP-CSGP_0402_L1W0.5H0.5]
C38  100nF ±5%_X7R  [WCAP-CSGP_0402_L1W0.5H0.5]
C39  100nF ±5%_X7R  [WCAP-CSGP_0402_L1W0.5H0.5]
C40  2.2uF ±5%_X7R  [WCAP-CSGP_0402_L1W0.5H0.5]
C41  22nF ±5%_X7R  [WCAP-CSGP_0402_L1W0.5H0.5]
C42  100nF ±5%_X7R  [WCAP-CSGP_0402_L1W0.5H0.5]
C43  100nF ±5%_X7R  [WCAP-CSGP_0402_L1W0.5H0.5]
C44  2.2uF ±5%_X7R  [WCAP-CSGP_0402_L1W0.5H0.5]
C45  2.2nF ±5%_X7R  [WCAP-CSGP_0402_L1W0.5H0.5]
C46  2.2nF ±5%_X7R  [WCAP-CSGP_0402_L1W0.5H0.5]
C47  2.2nF ±5%_X7R  [WCAP-CSGP_0402_L1W0.5H0.5]
C48  2.2nF ±5%_X7R  [WCAP-CSGP_0402_L1W0.5H0.5]
C49  2.2uF ±5%_X7R  [WCAP-CSGP_0402_L1W0.5H0.5]
C50  100nF ±5%_X7R  [WCAP-CSGP_0402_L1W0.5H0.5]
C51  4.7uF ±5%_X7R  [WCAP-CSGP_0603_L1.6W0.8H0.8_Reflow]
J7  MR30PB-F  [MR30PB-F [Straight] [SMT]]
NT1  6mil  [NETTIE_6mil]  (net tie, no BOM)
NT2  6mil  [NETTIE_6mil]  (net tie, no BOM)
NT3  6mil  [NETTIE_6mil]  (net tie, no BOM)
NT4  6mil  [NETTIE_6mil]  (net tie, no BOM)
NT5  6mil  [NETTIE_6mil]  (net tie, no BOM)
Q1  BSC027N04LSG  [NRVTS10100EMFST1G]  (value not drawn)
Q2  BSC027N04LSG  [NRVTS10100EMFST1G]  (value not drawn)
Q3  BSC027N04LSG  [NRVTS10100EMFST1G]  (value not drawn)
Q4  BSC027N04LSG  [NRVTS10100EMFST1G]  (value not drawn)
Q5  BSC027N04LSG  [NRVTS10100EMFST1G]  (value not drawn)
Q6  BSC027N04LSG  [NRVTS10100EMFST1G]  (value not drawn)
R23  3.3kΩ ±1% 62.5mW  [WRIS-KSKE_0402]
R24  22Ω ±1% 100mW  [WRIS-KSKE_0402]
R25  2.2Ω ±1% 100mW  [WRIS-KSKE_0402]
R26  2.2Ω ±1% 100mW  [WRIS-KSKE_0402]
R27  2.2Ω ±1% 100mW  [WRIS-KSKE_0402]
R28  18kΩ ±1% 100mW  [WRIS-KSKE_0402]
R29  22Ω ±1% 100mW  [WRIS-KSKE_0402]
R30  2.2Ω ±1% 100mW  [WRIS-KSKE_0402]
R31  2.2Ω ±1% 100mW  [WRIS-KSKE_0402]
R32  2.2Ω ±1% 100mW  [WRIS-KSKE_0402]
R33  120Ω ±1% 62.5mW  [WRIS-KSKE_0402]
R34  22Ω ±1% 62.5mW  [WRIS-KSKE_0402]
R35  500uΩ ±1% 200mW  [WRIS-KSKE_2512]
R36  500uΩ ±1% 200mW  [WRIS-KSKE_2512]
R37  22Ω ±1% 62.5mW  [WRIS-KSKE_0402]
R38  120Ω ±1% 62.5mW  [WRIS-KSKE_0402]
RT1  NTC_10kΩ ±1% 100mW  [WRIS-KSKE_0402]
U5  DRV8303DCA  [SOP50P810X120-49N]

### Ports
AH (see Top[3A]), AL (see Top[3A]), BH (see Top[3A]), BL (see Top[3B]), CH (see Top[3B]), CL (see Top[3B]), DC_CAL (see Top[3B]), EN_GATE (see Top[4A], MCU[5B], Motor1[1C]), nFAULT (see Top[4B], MCU[5B], Motor1[1C]), nSCS (see Top[4A]), SCLK (see Top[4B], Motor1[1C]), SDI (see Top[4B], Motor1[1C]), SDO (see Top[4B], Motor1[1C]), SO1 (see Top[3B]), SO2 (see Top[3B]), TEMP (see Top[4B])

### Nets
AGND: C37.1 C44.2 C47.1 C48.1 C49.1 R23.2 U5.24(AGND)
GND: C38.1 C40.1 C51.1 R28.2 U5.46(GND_1) U5.47(GND_2) U5.48(GND_3) U5.49(EP)
GVDD: C40.2 U5.9(GVDD)
PGND: C50.1 NT1.2 NT4.2 NT5.2 Q4.S R35.1 R36.1
VCC3V3_ASYS: RT1.1 U5.20(REF)
VCC3V3_SYS: C38.2 U5.45(VDD_SPI)
VCC16V8_BAT: C50.2 C51.2 Q1.D Q2.D Q3.D U5.25(PVDD)
EN_GATE: U5.12(EN_GATE) ; port EN_GATE
GH_A: R25.1 U5.43(GH_A)
GH_B: R26.1 U5.38(GH_B)
GH_C: R27.1 U5.33(GH_C)
GL_A: R30.1 U5.41(GL_A)
GL_B: R31.1 U5.36(GL_B)
GL_C: R32.1 U5.31(GL_C)
M0_nCS: U5.4(N_SCS) ; port nSCS
M0_SN1: NT2.1 R33.1
M0_SN2: NT3.1 R38.1
M0_SP1: C45.1 NT4.1 U5.28(SP1)
M0_SP2: C46.1 NT5.1 U5.26(SP2)
M0_TEMP: C37.2 R23.1 RT1.2 ; port TEMP
nFAULT: R24.1 ; port nFAULT
SH_A: C39.1 J7.3(W) Q1.S Q4.D U5.42(SH_A)
SH_B: C42.1 J7.2(V) Q2.S Q5.D U5.37(SH_B)
SH_C: C43.1 J7.1(U) Q3.S Q6.D U5.32(SH_C)
SL_A: NT1.1 U5.40(SL_A)
SL_B: NT2.2 Q5.S R35.2 U5.35(SL_B)
SL_C: NT3.2 Q6.S R36.2 U5.30(SL_C)
SPI_MISO: R29.1 ; port SDO
SPI_MOSI: U5.5(SDI) ; port SDI
SPI_SCK: U5.7(SCLK) ; port SCLK
NetC39_2: C39.2 U5.44(BST_A)
NetC41_1: C41.1 U5.10(CP1)
NetC41_2: C41.2 U5.11(CP2)
NetC42_2: C42.2 U5.39(BST_B)
NetC43_2: C43.2 U5.34(BST_C)
NetC44_1: C44.1 U5.19(DVDD)
NetC45_2: C45.2 R33.2 U5.29(SN1)
NetC46_2: C46.2 R38.2 U5.27(SN2)
NetC47_2: C47.2 R34.2 ; port SO1
NetC48_2: C48.2 R37.2 ; port SO2
NetC49_2: C49.2 U5.23(AVDD)
NetQ1_G: Q1.G R25.2
NetQ2_G: Q2.G R26.2
NetQ3_G: Q3.G R27.2
NetQ4_G: Q4.G R30.2
NetQ5_G: Q5.G R31.2
NetQ6_G: Q6.G R32.2
NetR24_2: R24.2 U5.2(N_FAULT)
NetR28_1: R28.1 U5.3(DTC)
NetR29_2: R29.2 U5.6(SDO)
NetR34_1: R34.1 U5.21(SO1)
NetR37_1: R37.1 U5.22(SO2)
NetU4_34: U5.14(INL_A) ; port AL
NetU4_35: U5.16(INL_B) ; port BL
NetU4_36: U5.18(INL_C) ; port CL
NetU4_40: U5.8(DC_CAL) ; port DC_CAL
NetU4_41: U5.13(INH_A) ; port AH
NetU4_42: U5.15(INH_B) ; port BH
NetU4_43: U5.17(INH_C) ; port CH

Not connected (* = marked no-connect by the designer): U5 1(N_OCTW)*

### Notes on the sheet
- TEMP
- M0
- DRIVER
- MOSFET
- MOSFET: NTMFS4935NT1G

### Library data of the parts
C37-C39 C41-C43 C45-C48 C50 C51 = Cap: Capacitor; Published: 8-Jun-2000; LatestRevisionDate: 17-Jul-2002; LatestRevisionNote: Re-released for DXP Platform.; PackageReference: RAD-0.3; Publisher: Altium Limited; PackageDescription: Radial Cap, Thru-Hole; 2 Leads; 0.3 in Pin Spacing
C40 C44 C49 = Cap: CL05A225KO5NQNC; Published: 8-Jun-2000; LatestRevisionDate: 17-Jul-2002; LatestRevisionNote: Re-released for DXP Platform.; PackageReference: RAD-0.3; Publisher: Altium Limited; PackageDescription: Radial Cap, Thru-Hole; 2 Leads; 0.3 in Pin Spacing
J7 = MR30PB-F [Straight] [SMT]: 驱动器端
NT1-NT5 = NETTIE
Q1-Q6 = MOSFET-N: as Q13 on sheet AuxHalfH; Supplier 1: Digi-Key; Supplier Part Number 1: NTMFS4935NT1GOSCT-ND; RoHS: RoHS Compliant; Category: Discrete Semiconductor Products; Stock 1: 932; Pricing 1: 1=0.61, 10=0.541, 100=0.4145, 500=0.3277 (USD); Packaging: Cut Tape (CT); Part Status: Active; FET Type: N-Channel; Technology: MOSFET (Metal Oxide); FET Feature: -; Operating Temperature: -55°C ~ 150°C (TJ); Mounting Type: Surface Mount; Supplier Device Package: 5-DFN (5x6) (8-SOFL); Package / Case: 8-PowerTDFN, 5 Leads; ComponentLink1URL: http://www.onsemi.com/pub_link/Collateral/NTMFS4935N-D.PDF; ComponentLink1Description: http://www.onsemi.com/pub_link/Collateral/NTMFS4935N-D.PDF
R23-R38 = Res: Resistor; Published: 8-Jun-2000; LatestRevisionDate: 17-Jul-2002; LatestRevisionNote: Re-released for DXP Platform.; PackageReference: AXIAL-0.3; Publisher: Altium Limited; PackageDescription: Axial Device, Thru-Hole; 2 Leads; 0.3 in Pin Spacing
RT1 = TEMP RES: THERMISTOR 10K OHM NTC 0402 SMD
U5 = DRV8303DCA: Integrated Circuit; Manufacturer_Name: Texas Instruments; Datasheet Link: https://componentsearchengine.com/Datasheets/2/DRV8303DCA.pdf; Height: 1.2mm; Manufacturer_Part_Number: DRV8303DCA; Mouser Part Number: 595-DRV8303DCA; Mouser Price/Stock: https://www.mouser.co.uk/ProductDetail/Texas-Instruments/DRV8303DCA?qs=igp4D3uu33KLowzNFy6WPA%3D%3D; Arrow Part Number: DRV8303DCA; Arrow Price/Stock: https://www.arrow.com/en/products/drv8303dca/texas-instruments

## Sheet Motor1.SchDoc
size A3; DocumentNumber: 2; SheetNumber: 4; SheetTotal: 5
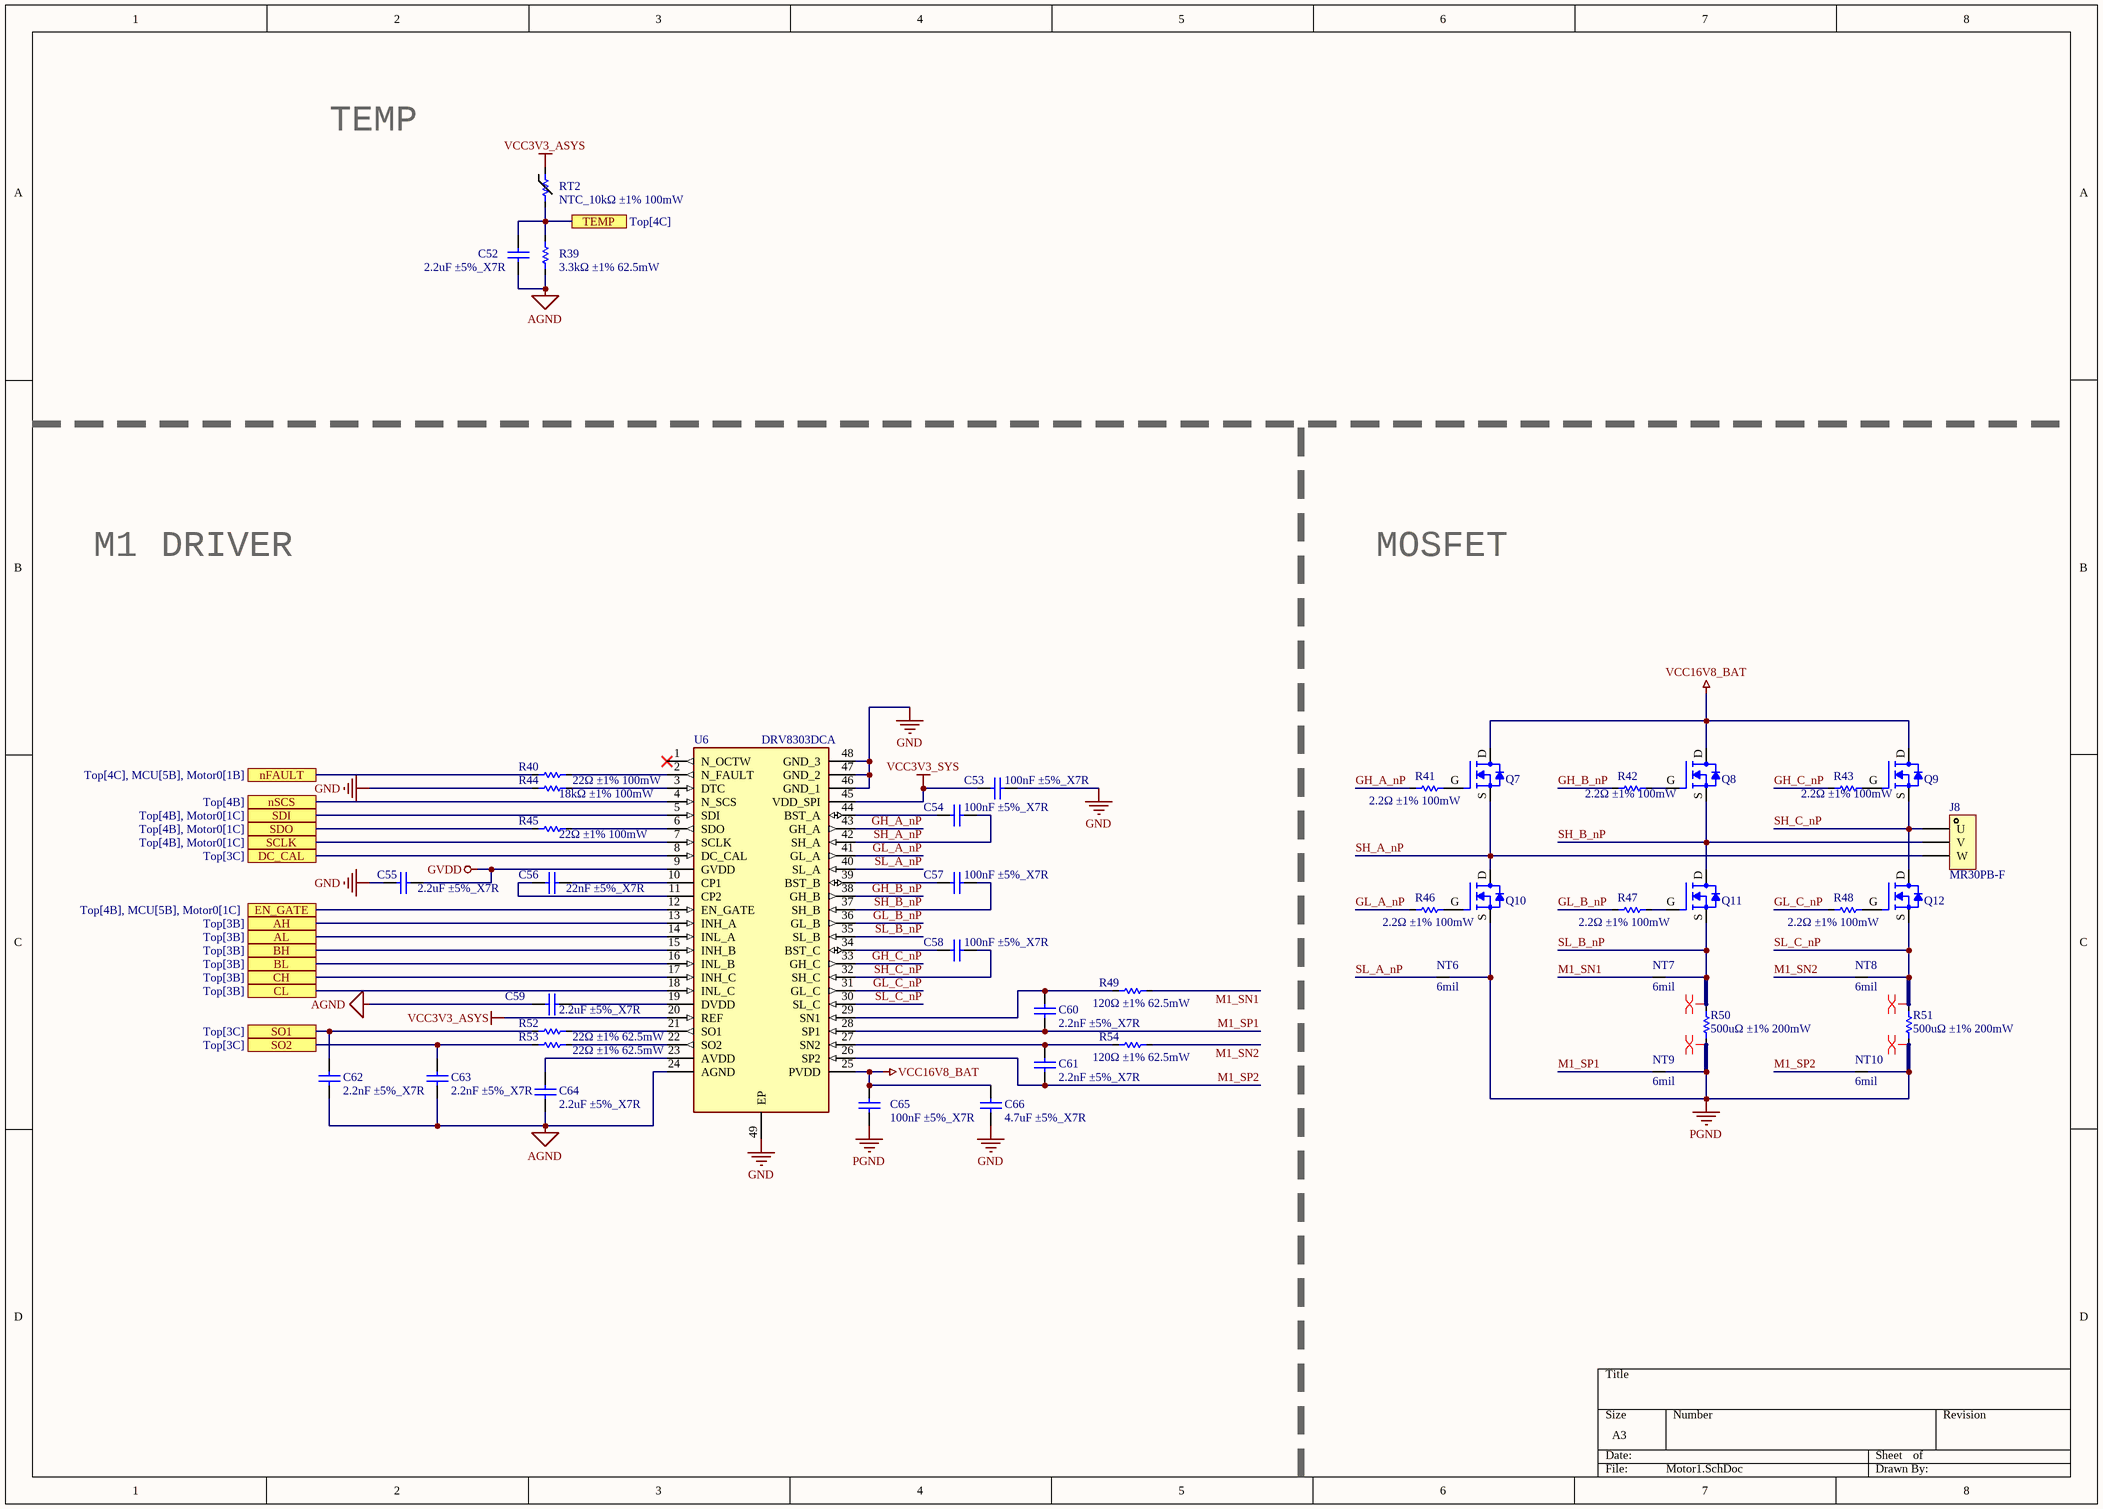
[diagram p4: Motor1.SchDoc]

### Parts
C52  2.2uF ±5%_X7R  [WCAP-CSGP_0402_L1W0.5H0.5]
C53  100nF ±5%_X7R  [WCAP-CSGP_0402_L1W0.5H0.5]
C54  100nF ±5%_X7R  [WCAP-CSGP_0402_L1W0.5H0.5]
C55  2.2uF ±5%_X7R  [WCAP-CSGP_0402_L1W0.5H0.5]
C56  22nF ±5%_X7R  [WCAP-CSGP_0402_L1W0.5H0.5]
C57  100nF ±5%_X7R  [WCAP-CSGP_0402_L1W0.5H0.5]
C58  100nF ±5%_X7R  [WCAP-CSGP_0402_L1W0.5H0.5]
C59  2.2uF ±5%_X7R  [WCAP-CSGP_0402_L1W0.5H0.5]
C60  2.2nF ±5%_X7R  [WCAP-CSGP_0402_L1W0.5H0.5]
C61  2.2nF ±5%_X7R  [WCAP-CSGP_0402_L1W0.5H0.5]
C62  2.2nF ±5%_X7R  [WCAP-CSGP_0402_L1W0.5H0.5]
C63  2.2nF ±5%_X7R  [WCAP-CSGP_0402_L1W0.5H0.5]
C64  2.2uF ±5%_X7R  [WCAP-CSGP_0402_L1W0.5H0.5]
C65  100nF ±5%_X7R  [WCAP-CSGP_0402_L1W0.5H0.5]
C66  4.7uF ±5%_X7R  [WCAP-CSGP_0603_L1.6W0.8H0.8_Reflow]
J8  MR30PB-F  [MR30PB-F [Straight] [SMT]]
NT6  6mil  [NETTIE_6mil]  (net tie, no BOM)
NT7  6mil  [NETTIE_6mil]  (net tie, no BOM)
NT8  6mil  [NETTIE_6mil]  (net tie, no BOM)
NT9  6mil  [NETTIE_6mil]  (net tie, no BOM)
NT10  6mil  [NETTIE_6mil]  (net tie, no BOM)
Q7  BSC027N04LSG  [NRVTS10100EMFST1G]  (value not drawn)
Q8  BSC027N04LSG  [NRVTS10100EMFST1G]  (value not drawn)
Q9  BSC027N04LSG  [NRVTS10100EMFST1G]  (value not drawn)
Q10  BSC027N04LSG  [NRVTS10100EMFST1G]  (value not drawn)
Q11  BSC027N04LSG  [NRVTS10100EMFST1G]  (value not drawn)
Q12  BSC027N04LSG  [NRVTS10100EMFST1G]  (value not drawn)
R39  3.3kΩ ±1% 62.5mW  [WRIS-KSKE_0402]
R40  22Ω ±1% 100mW  [WRIS-KSKE_0402]
R41  2.2Ω ±1% 100mW  [WRIS-KSKE_0402]
R42  2.2Ω ±1% 100mW  [WRIS-KSKE_0402]
R43  2.2Ω ±1% 100mW  [WRIS-KSKE_0402]
R44  18kΩ ±1% 100mW  [WRIS-KSKE_0402]
R45  22Ω ±1% 100mW  [WRIS-KSKE_0402]
R46  2.2Ω ±1% 100mW  [WRIS-KSKE_0402]
R47  2.2Ω ±1% 100mW  [WRIS-KSKE_0402]
R48  2.2Ω ±1% 100mW  [WRIS-KSKE_0402]
R49  120Ω ±1% 62.5mW  [WRIS-KSKE_0402]
R50  500uΩ ±1% 200mW  [WRIS-KSKE_2512]
R51  500uΩ ±1% 200mW  [WRIS-KSKE_2512]
R52  22Ω ±1% 62.5mW  [WRIS-KSKE_0402]
R53  22Ω ±1% 62.5mW  [WRIS-KSKE_0402]
R54  120Ω ±1% 62.5mW  [WRIS-KSKE_0402]
RT2  NTC_10kΩ ±1% 100mW  [WRIS-KSKE_0402]
U6  DRV8303DCA  [SOP50P810X120-49N]

### Ports
AH (see Top[3B]), AL (see Top[3B]), BH (see Top[3B]), BL (see Top[3B]), CH (see Top[3B]), CL (see Top[3B]), DC_CAL (see Top[3C]), EN_GATE (see Top[4B], MCU[5B], Motor0[1C]), nFAULT (see Top[4C], MCU[5B], Motor0[1B]), nSCS (see Top[4B]), SCLK (see Top[4B], Motor0[1C]), SDI (see Top[4B], Motor0[1C]), SDO (see Top[4B], Motor0[1C]), SO1 (see Top[3C]), SO2 (see Top[3C]), TEMP (see Top[4C])

### Nets
AGND: C52.1 C59.2 C62.1 C63.1 C64.1 R39.1 U6.24(AGND)
GND: C53.1 C55.1 C66.1 R44.2 U6.46(GND_1) U6.47(GND_2) U6.48(GND_3) U6.49(EP)
GVDD: C55.2 U6.9(GVDD)
PGND: C65.1 NT6.1 NT9.2 NT10.2 Q10.S R50.1 R51.1
VCC3V3_ASYS: RT2.1 U6.20(REF)
VCC3V3_SYS: C53.2 U6.45(VDD_SPI)
VCC16V8_BAT: C65.2 C66.2 Q7.D Q8.D Q9.D U6.25(PVDD)
EN_GATE: U6.12(EN_GATE) ; port EN_GATE
GH_A_nP: R41.2 U6.43(GH_A)
GH_B_nP: R42.2 U6.38(GH_B)
GH_C_nP: R43.2 U6.33(GH_C)
GL_A_nP: R46.2 U6.41(GL_A)
GL_B_nP: R47.2 U6.36(GL_B)
GL_C_nP: R48.2 U6.31(GL_C)
M1_nCS: U6.4(N_SCS) ; port nSCS
M1_SN1: NT7.1 R49.1
M1_SN2: NT8.1 R54.1
M1_SP1: C60.1 NT9.1 U6.28(SP1)
M1_SP2: C61.1 NT10.1 U6.26(SP2)
M1_TEMP: C52.2 R39.2 RT2.2 ; port TEMP
nFAULT: R40.1 ; port nFAULT
SH_A_nP: C54.1 J8.3(W) Q7.S Q10.D U6.42(SH_A)
SH_B_nP: C57.1 J8.2(V) Q8.S Q11.D U6.37(SH_B)
SH_C_nP: C58.1 J8.1(U) Q9.S Q12.D U6.32(SH_C)
SL_A_nP: NT6.2 U6.40(SL_A)
SL_B_nP: NT7.2 Q11.S R50.2 U6.35(SL_B)
SL_C_nP: NT8.2 Q12.S R51.2 U6.30(SL_C)
SPI_MISO: R45.1 ; port SDO
SPI_MOSI: U6.5(SDI) ; port SDI
SPI_SCK: U6.7(SCLK) ; port SCLK
NetC54_2: C54.2 U6.44(BST_A)
NetC56_1: C56.1 U6.10(CP1)
NetC56_2: C56.2 U6.11(CP2)
NetC57_2: C57.2 U6.39(BST_B)
NetC58_2: C58.2 U6.34(BST_C)
NetC59_1: C59.1 U6.19(DVDD)
NetC60_2: C60.2 R49.2 U6.29(SN1)
NetC61_2: C61.2 R54.2 U6.27(SN2)
NetC62_2: C62.2 R52.2 ; port SO1
NetC63_2: C63.2 R53.2 ; port SO2
NetC64_2: C64.2 U6.23(AVDD)
NetQ7_G: Q7.G R41.1
NetQ8_G: Q8.G R42.1
NetQ9_G: Q9.G R43.1
NetQ10_G: Q10.G R46.1
NetQ11_G: Q11.G R47.1
NetQ12_G: Q12.G R48.1
NetR40_2: R40.2 U6.2(N_FAULT)
NetR44_1: R44.1 U6.3(DTC)
NetR45_2: R45.2 U6.6(SDO)
NetR52_1: R52.1 U6.21(SO1)
NetR53_1: R53.1 U6.22(SO2)
NetU4_4: U6.8(DC_CAL) ; port DC_CAL
NetU4_23: U6.14(INL_A) ; port AL
NetU4_26: U6.16(INL_B) ; port BL
NetU4_27: U6.18(INL_C) ; port CL
NetU4_37: U6.13(INH_A) ; port AH
NetU4_38: U6.15(INH_B) ; port BH
NetU4_39: U6.17(INH_C) ; port CH

Not connected (* = marked no-connect by the designer): U6 1(N_OCTW)*

### Notes on the sheet
- TEMP
- M1
- DRIVER
- MOSFET

### Library data of the parts
C52-C54 C56-C58 C60-C63 C65 C66 = Cap: Capacitor; Published: 8-Jun-2000; LatestRevisionDate: 17-Jul-2002; LatestRevisionNote: Re-released for DXP Platform.; PackageReference: RAD-0.3; Publisher: Altium Limited; PackageDescription: Radial Cap, Thru-Hole; 2 Leads; 0.3 in Pin Spacing
C55 C59 C64 = Cap: CL05A225KO5NQNC; Published: 8-Jun-2000; LatestRevisionDate: 17-Jul-2002; LatestRevisionNote: Re-released for DXP Platform.; PackageReference: RAD-0.3; Publisher: Altium Limited; PackageDescription: Radial Cap, Thru-Hole; 2 Leads; 0.3 in Pin Spacing
J8 = MR30PB-F [Straight] [SMT]: 驱动器端
NT6-NT10 = NETTIE
Q7-Q12 = MOSFET-N: as Q13 on sheet AuxHalfH; Supplier 1: Digi-Key; Supplier Part Number 1: NTMFS4935NT1GOSCT-ND; RoHS: RoHS Compliant; Category: Discrete Semiconductor Products; Stock 1: 932; Pricing 1: 1=0.61, 10=0.541, 100=0.4145, 500=0.3277 (USD); Packaging: Cut Tape (CT); Part Status: Active; FET Type: N-Channel; Technology: MOSFET (Metal Oxide); FET Feature: -; Operating Temperature: -55°C ~ 150°C (TJ); Mounting Type: Surface Mount; Supplier Device Package: 5-DFN (5x6) (8-SOFL); Package / Case: 8-PowerTDFN, 5 Leads; ComponentLink1URL: http://www.onsemi.com/pub_link/Collateral/NTMFS4935N-D.PDF; ComponentLink1Description: http://www.onsemi.com/pub_link/Collateral/NTMFS4935N-D.PDF
R39-R54 = Res: Resistor; Published: 8-Jun-2000; LatestRevisionDate: 17-Jul-2002; LatestRevisionNote: Re-released for DXP Platform.; PackageReference: AXIAL-0.3; Publisher: Altium Limited; PackageDescription: Axial Device, Thru-Hole; 2 Leads; 0.3 in Pin Spacing
RT2 = TEMP RES: THERMISTOR 10K OHM NTC 0402 SMD
U6 = DRV8303DCA: as U5 on sheet Motor0; Datasheet Link: https://componentsearchengine.com/Datasheets/2/DRV8303DCA.pdf; Height: 1.2mm; Manufacturer_Part_Number: DRV8303DCA; Mouser Part Number: 595-DRV8303DCA; Mouser Price/Stock: https://www.mouser.co.uk/ProductDetail/Texas-Instruments/DRV8303DCA?qs=igp4D3uu33KLowzNFy6WPA%3D%3D; Arrow Part Number: DRV8303DCA; Arrow Price/Stock: https://www.arrow.com/en/products/drv8303dca/texas-instruments

## Sheet Power.SchDoc
size A4; DocumentNumber: 4; SheetNumber: 2; SheetTotal: 5; SPICEModelCache: <root> / <DocumentId>FYMTCRTF</DocumentId> / <CacheFrame Number="0"> / <Model Name="3020_74438336033_3.3u" Kind="CKT"> / <Text>******* / .subckt 3020_74438336033_3.3u 1 2 / Rp 1 2 6097.32637741 / Cp 1 2 5.7471916388p / Rs 1 N3 0.099 / L1 N3 2 2.92u / .ends 3020_74438336033_3.3u</Text> / </Model> / </CacheFrame> / </root>
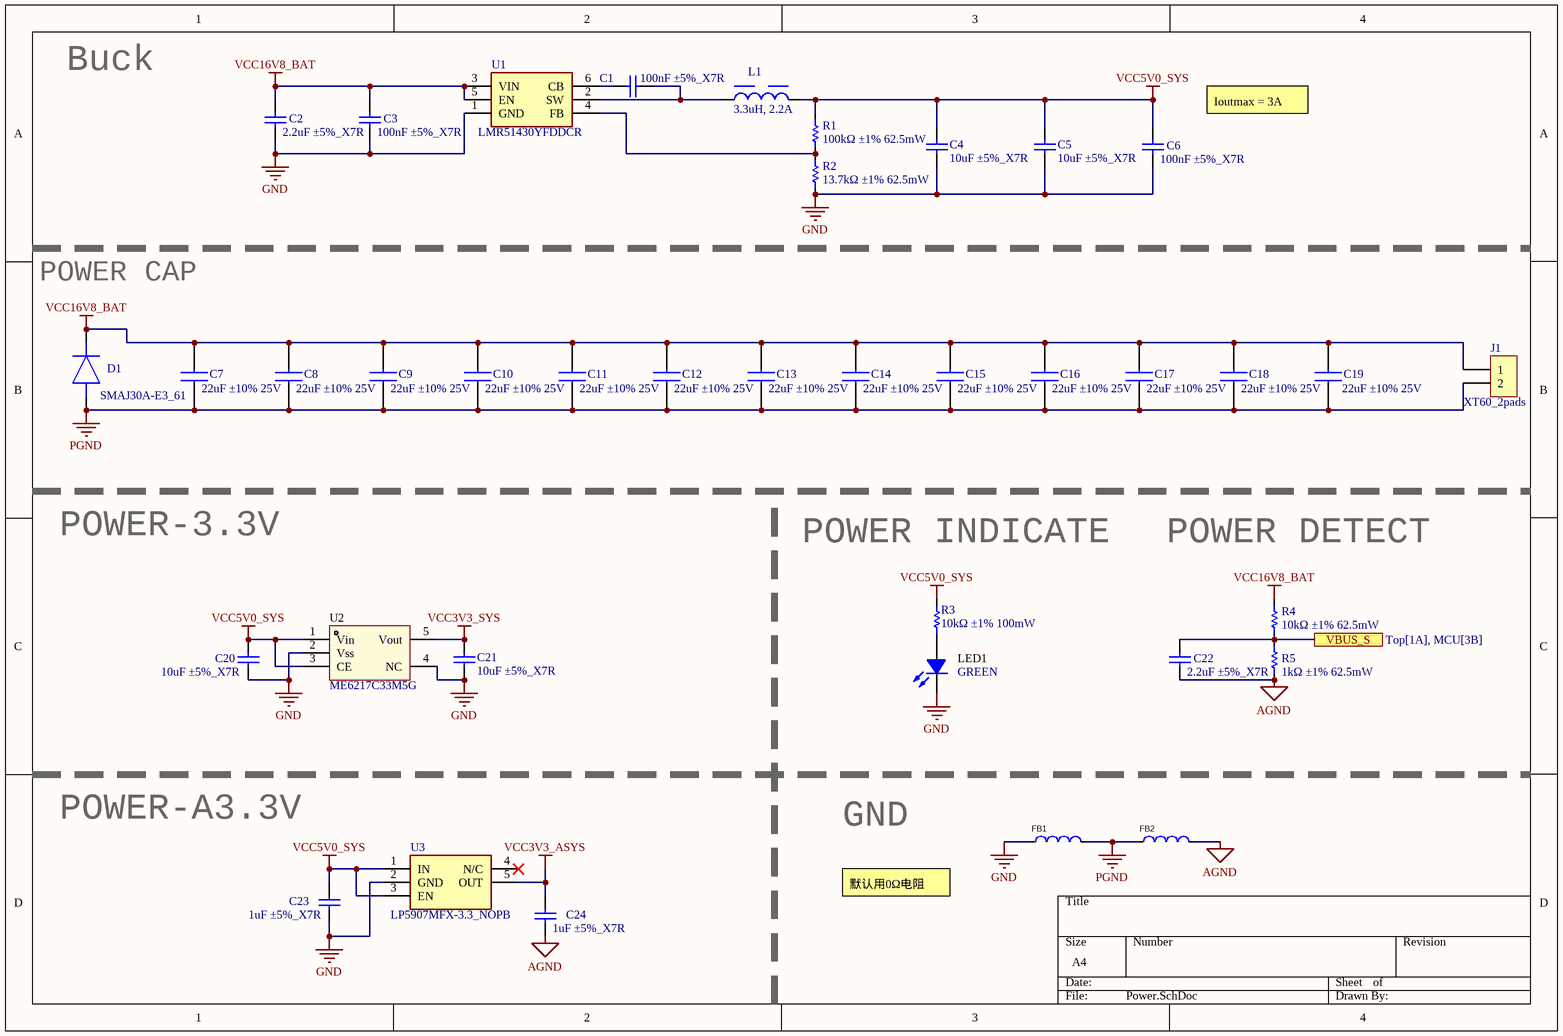
[diagram p5: Power.SchDoc]

### Parts
C1  100nF ±5%_X7R  [WCAP-CSGP_0402_L1W0.5H0.5]
C2  2.2uF ±5%_X7R  [WCAP-CSGP_0603_L1.6W0.8H0.8_Reflow]
C3  100nF ±5%_X7R  [WCAP-CSGP_0402_L1W0.5H0.5]
C4  10uF ±5%_X7R  [WCAP-CSGP_0603_L1.6W0.8H0.8_Reflow]
C5  10uF ±5%_X7R  [WCAP-CSGP_0603_L1.6W0.8H0.8_Reflow]
C6  100nF ±5%_X7R  [WCAP-CSGP_0402_L1W0.5H0.5]
C7  22uF ±10% 25V  [CAPC3225X270N]
C8  22uF ±10% 25V  [CAPC3225X270N]
C9  22uF ±10% 25V  [CAPC3225X270N]
C10  22uF ±10% 25V  [CAPC3225X270N]
C11  22uF ±10% 25V  [CAPC3225X270N]
C12  22uF ±10% 25V  [CAPC3225X270N]
C13  22uF ±10% 25V  [CAPC3225X270N]
C14  22uF ±10% 25V  [CAPC3225X270N]
C15  22uF ±10% 25V  [CAPC3225X270N]
C16  22uF ±10% 25V  [CAPC3225X270N]
C17  22uF ±10% 25V  [CAPC3225X270N]
C18  22uF ±10% 25V  [CAPC3225X270N]
C19  22uF ±10% 25V  [CAPC3225X270N]
C20  10uF ±5%_X7R  [WCAP-CSGP_0603_L1.6W0.8H0.8_Reflow]
C21  10uF ±5%_X7R  [WCAP-CSGP_0603_L1.6W0.8H0.8_Reflow]
C22  2.2uF ±5%_X7R  [WCAP-CSGP_0402_L1W0.5H0.5]
C23  1uF ±5%_X7R  [WCAP-CSGP_0603_L1.6W0.8H0.8_Reflow]
C24  1uF ±5%_X7R  [WCAP-CSGP_0603_L1.6W0.8H0.8_Reflow]
D1  SMAJ30A-E3_61  [DIOM5127X229N]
FB1  ?Ω@100MHz  [BEADC1608X75N]  (value not drawn)
FB2  ?Ω@100MHz  [BEADC1608X75N]  (value not drawn)
J1  XT60_2pads  [XT60_2pads]
L1  3.3uH, 2.2A  [WE-MAPI_3020]
LED1  GREEN  [LED0603-RD]
R1  100kΩ ±1% 62.5mW  [WRIS-KSKE_0402]
R2  13.7kΩ ±1% 62.5mW  [WRIS-KSKE_0402]
R3  10kΩ ±1% 100mW  [R0603]
R4  10kΩ ±1% 62.5mW  [WRIS-KSKE_0402]
R5  1kΩ ±1% 62.5mW  [WRIS-KSKE_0402]
U1  LMR51430YFDDCR  [SOT95P280X110-6N]
U2  ME6217C33M5G  [SOT-23-5_L3.0-W1.7-P0.95-LS2.8-BR]
U3  LP5907MFX-3.3_NOPB  [SOT95P280X145-5N]

### Ports
VBUS_S (see Top[1A], MCU[3B])

### Nets
AGND: C22.1 C24.1 FB2.2 R5.1
GND: C2.1 C3.1 C4.1 C5.1 C6.1 C20.1 C21.1 C23.1 FB1.1 LED1.2(K) R2.1 U1.1(GND) U2.2(Vss) U2.4(NC) U3.2(GND)
PGND: C7.1 C8.1 C9.1 C10.1 C11.1 C12.1 C13.1 C14.1 C15.1 C16.1 C17.1 C18.1 C19.1 D1.2(A) FB1.2 FB2.1 J1.2
VCC3V3_ASYS: C24.2 U3.5(OUT)
VCC3V3_SYS: C21.2 U2.5(Vout)
VCC5V0_SYS: C4.2 C5.2 C6.2 C20.2 C23.2 L1.2 R1.2 R3.2 U2.1(Vin) U2.3(CE) U3.1(IN) U3.3(EN)
VCC16V8_BAT: C2.2 C3.2 C7.2 C8.2 C9.2 C10.2 C11.2 C12.2 C13.2 C14.2 C15.2 C16.2 C17.2 C18.2 C19.2 D1.1(K) J1.1 R4.2 U1.3(VIN) U1.5(EN)
VBUS_S: C22.2 R4.1 R5.2 ; port VBUS_S
NetC1_1: C1.1 L1.1 U1.2(SW)
NetC1_2: C1.2 U1.6(CB)
NetLED1_1: LED1.1(A) R3.1
NetR1_1: R1.1 R2.2 U1.4(FB)

Not connected (* = marked no-connect by the designer): U3 4(N/C)*

### Notes on the sheet
- Buck
- Ioutmax = 3A
- POWER CAP
- POWER-3.3V
- POWER INDICATE
- POWER DETECT
- POWER-A3.3V
- GND
- 默认用0Ω电阻

### Library data of the parts
C1-C6 C20-C24 = Cap: Capacitor; Published: 8-Jun-2000; LatestRevisionDate: 17-Jul-2002; LatestRevisionNote: Re-released for DXP Platform.; PackageReference: RAD-0.3; Publisher: Altium Limited; PackageDescription: Radial Cap, Thru-Hole; 2 Leads; 0.3 in Pin Spacing
C7-C19 = CL32A226KAJNNNE: Capacitor; Manufacturer_Name: SAMSUNG; Datasheet Link: https://www.arrow.com/en/products/cl32a226kajnnne/samsung-electro-mechanics; Height: 2.7mm; Manufacturer_Part_Number: CL32A226KAJNNNE; Mouser Part Number: 187-CL32A226KAJNNNE; Mouser Price/Stock: https://www.mouser.co.uk/ProductDetail/Samsung-Electro-Mechanics/CL32A226KAJNNNE?qs=hqM3L16%252BxlenZa7Di5a%252Buw%3D%3D; Arrow Part Number: CL32A226KAJNNNE; Arrow Price/Stock: https://www.arrow.com/en/products/cl32a226kajnnne/samsung-electro-mechanics?region=nac
D1 = SMAJ30A-E3_61: Diode; Manufacturer_Name: Vishay; Manufacturer_Part_Number: SMAJ30A-E3/61; Datasheet Link: http://www.vishay.com/docs/88390/smaj50a.pdf; Height: 2.29mm; Mouser Part Number: 625-SMAJ30A-E3; Mouser Price/Stock: https://www.mouser.co.uk/ProductDetail/Vishay-General-Semiconductor/SMAJ30A-E3-61?qs=M2MvrwIlMUxWAZKdikEp%2Fw%3D%3D; Arrow Part Number: SMAJ30A-E3/61; Arrow Price/Stock: https://www.arrow.com/en/products/smaj30a-e361/vishay?region=nac
FB1 FB2 = Ferrite Bead: MPZ1608S601ATA00; Manufacturer: FH(风华); Name: CBW321609U601T; Add into BOM: yes; Impedance @ Frequency: 600Ω@100MHz; Tolerance: ±25%; DC Resistance: 250mΩ; Current Rating: 2A; Circuits: 1; Symbol: CBW321609U601T; Device: CBW321609U601T; LCSC Part Name: 600Ω@100MHz ±25%; Supplier Part: C73732; Manufacturer Part: CBW321609U601T; Supplier Footprint: SMD; JLCPCB Part Class: Extended Part; Datasheet: https://atta.szlcsc.com/upload/public/pdf/source/20160606/1465200211209.pdf; Supplier: LCSC; Convert to PCB: yes
L1 = 74438336033: WE-MAPI, size 3020, 3.3uH, 2.2A, 114mOhm; Manufacturer: Wurth Elektronik; Case/Size Code: 3020; DC Resistance: 99mOhm; Saturation Current: 4.25A; Self Resonant Frequency: 39MHz; Manufacturer Part Number: 74438336033; Match Code: WE-MAPI; ComponentLink1Description: Website Link; ComponentLink1URL: https://www.we-online.com/redexpert/article/74438336033?ad; ComponentLink2Description: Datasheet Link; ComponentLink2URL: https://www.we-online.com/redexpert/spec/74438336033?ad; Mount: Surface Mount; Operating Temperature Max: 125°C; Operating Temperature Min: -40°C; Packaging: Tape and Reel; Length: 3mm; Width: 3mm; Height: 2mm; DC Resistance Max: 114mOhm; Inductance: 3.3uH; Rated Current: 2.2A
LED1 = LED: 发光颜色:; Manufacturer: EVERLIGHT(亿光); Name: 17-21SURC/S530-A2/TR8; Add into BOM: yes; Emitted Color: 红灯; Symbol: 17-21SURC/S530-A2/TR8; Device: 17-21SURC/S530-A2/TR8; LCSC Part Name: 红灯; Supplier Part: C131244; Manufacturer Part: 17-21SURC/S530-A2/TR8; Supplier Footprint: 0805; JLCPCB Part Class: Extended Part; Datasheet: https://atta.szlcsc.com/upload/public/pdf/source/20170918/C131244_1505726880590976254.pdf; Supplier: LCSC; Convert to PCB: yes
R1-R5 = Res: Resistor; Published: 8-Jun-2000; LatestRevisionDate: 17-Jul-2002; LatestRevisionNote: Re-released for DXP Platform.; PackageReference: AXIAL-0.3; Publisher: Altium Limited; PackageDescription: Axial Device, Thru-Hole; 2 Leads; 0.3 in Pin Spacing
U1 = LMR51430YFDDCR: Integrated Circuit; Manufacturer_Name: Texas Instruments; Datasheet Link: https://www.ti.com/lit/gpn/LMR51430; Height: 1.1mm; Manufacturer_Part_Number: LMR51430YFDDCR; Mouser Part Number: 595-LMR51430YFDDCR; Mouser Price/Stock: https://www.mouser.co.uk/ProductDetail/Texas-Instruments/LMR51430YFDDCR?qs=vvQtp7zwQdObTljc3WTMYQ%3D%3D; Arrow Part Number: LMR51430YFDDCR; Arrow Price/Stock: null?utm_currency=USD&region=nac
U2 = ME6217C33M5G: Manufacturer: MICRONE(南京微盟); Add into BOM: yes; Output Type: 固定; Output Polarity: 正; Number of Outputs: 1; Maximum Input Voltage: 7V; Output Voltage: 3.3V; Dropout Voltage: 180mV@(300mA); Output Current: 800mA; Power Supply Rejection Ratio (PSRR): 65dB@(1kHz); Name: ME6217C33M5G; Symbol: ME6217C33M5G; Device: ME6217C33M5G; LCSC Part Name: ME6217C33M5G; Supplier Part: C427602; Manufacturer Part: ME6217C33M5G; Supplier Footprint: SOT-23-5; JLCPCB Part Class: Extended Part; Datasheet: https://atta.szlcsc.com/upload/public/pdf/source/20190910/C427602_D4B9162A2E9D9EF57C60010DFDECEF37.pdf; Supplier: LCSC; Convert to PCB: yes; Quiescent Current (Ground Current): -
U3 = LP5907MFX-3.3_NOPB: Integrated Circuit; Manufacturer_Name: Texas Instruments; Manufacturer_Part_Number: LP5907MFX-3.3/NOPB; Datasheet Link: https://datasheet.datasheetarchive.com/originals/distributors/Datasheets-SFU2/DSASFU100037200.pdf; Height: 1.45mm; Mouser Part Number: 595-LP5907MFX-3.3NPB; Mouser Price/Stock: https://www.mouser.co.uk/ProductDetail/Texas-Instruments/LP5907MFX-3.3-NOPB?qs=biyDIajrTn6NhrJCoL%2FdSQ%3D%3D; Arrow Part Number: LP5907MFX-3.3/NOPB; Arrow Price/Stock: https://www.arrow.com/en/products/lp5907mfx-3.3nopb/texas-instruments?utm_currency=USD&region=nac

## Sheet Port.SchDoc
size A4
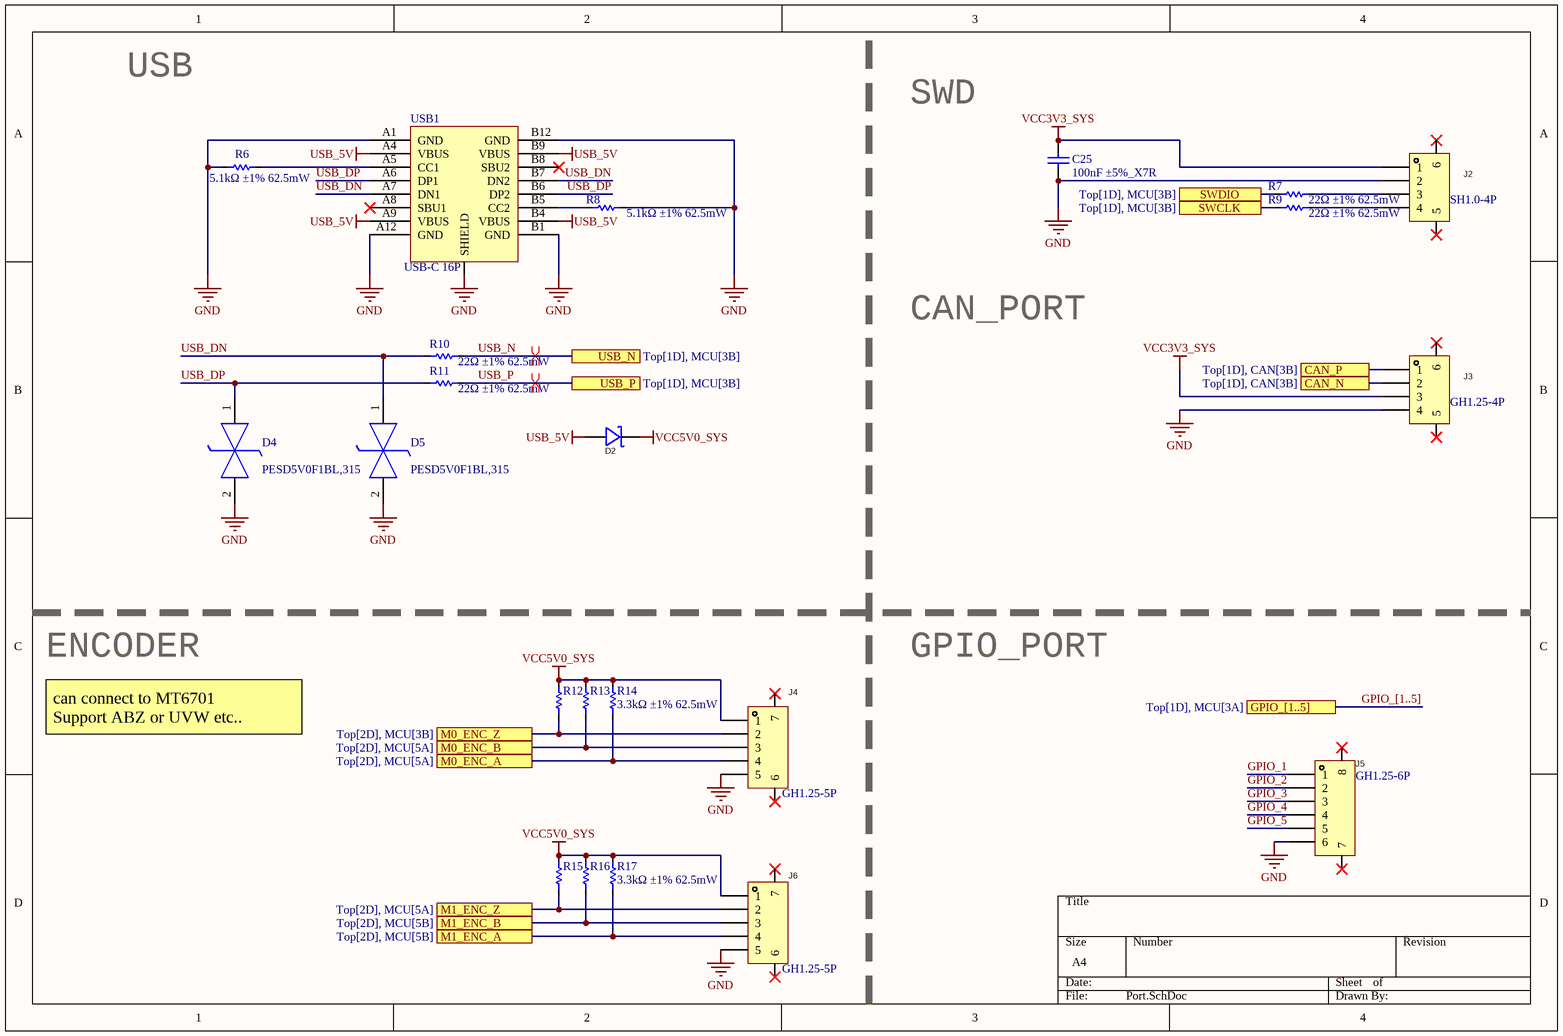
[diagram p6: Port.SchDoc]

### Parts
C25  100nF ±5%_X7R  [WCAP-CSGP_0402_L1W0.5H0.5]
D2  B340A-13-F  [SMA_L4.4-W2.6-LS5.0-RD]  (value not drawn)
D4  PESD5V0F1BL,315  [PESD5V0S1BL315]
D5  PESD5V0F1BL,315  [PESD5V0S1BL315]
J2  SH1.0-4P  [CONN-SMD_4P-P1.00_BX-SH1.0-4PWT]
J3  GH1.25-4P  [GH1.25-4P]
J4  GH1.25-5P  [GH1.25-5P]
J5  GH1.25-6P  [GH1.25-6P]
J6  GH1.25-5P  [GH1.25-5P]
R6  5.1kΩ ±1% 62.5mW  [WRIS-KSKE_0402]
R7  22Ω ±1% 62.5mW  [WRIS-KSKE_0402]
R8  5.1kΩ ±1% 62.5mW  [WRIS-KSKE_0402]
R9  22Ω ±1% 62.5mW  [WRIS-KSKE_0402]
R10  22Ω ±1% 62.5mW  [WRIS-KSKE_0402]
R11  22Ω ±1% 62.5mW  [WRIS-KSKE_0402]
R12  3.3kΩ ±1% 62.5mW  [WRIS-KSKE_0402]  (value not drawn)
R13  3.3kΩ ±1% 62.5mW  [WRIS-KSKE_0402]  (value not drawn)
R14  3.3kΩ ±1% 62.5mW  [WRIS-KSKE_0402]
R15  3.3kΩ ±1% 62.5mW  [WRIS-KSKE_0402]  (value not drawn)
R16  3.3kΩ ±1% 62.5mW  [WRIS-KSKE_0402]  (value not drawn)
R17  3.3kΩ ±1% 62.5mW  [WRIS-KSKE_0402]
USB1  USB-C 16P  [USB-C-16P]

### Ports
CAN_N (see Top[1D], CAN[3B]), CAN_P (see Top[1D], CAN[3B]), GPIO_[1..5] (see Top[1D], MCU[3A]), M0_ENC_A (see Top[2D], MCU[5A]), M0_ENC_B (see Top[2D], MCU[5A]), M0_ENC_Z (see Top[2D], MCU[3B]), M1_ENC_A (see Top[2D], MCU[5B]), M1_ENC_B (see Top[2D], MCU[5B]), M1_ENC_Z (see Top[2D], MCU[5A]), SWCLK (see Top[1D], MCU[3B]), SWDIO (see Top[1D], MCU[3B]), USB_N (see Top[1D], MCU[3B]), USB_P (see Top[1D], MCU[3B])

### Nets
GND: C25.1 D4.2(K2) D5.2(K2) J2.2 J3.4 J4.5 J5.6 J6.5 R6.1 R8.2 USB1.0(SHIELD) USB1.A1(GND) USB1.A12(GND) USB1.B1(GND) USB1.B12(GND)
USB_5V: D2.2(A) USB1.A4(VBUS) USB1.A9(VBUS) USB1.B4(VBUS) USB1.B9(VBUS)
VCC3V3_SYS: C25.2 J2.1 J3.3
VCC5V0_SYS: D2.1(K) J4.1 J6.1 R12.2 R13.2 R14.2 R15.2 R16.2 R17.2
CAN_N: J3.2 ; port CAN_N
CAN_P: J3.1 ; port CAN_P
GPIO_1: J5.1
GPIO_2: J5.2
GPIO_3: J5.3
GPIO_4: J5.4
GPIO_5: J5.5
M0_ENC_A: J4.4 R14.1 ; port M0_ENC_A
M0_ENC_B: J4.3 R13.1 ; port M0_ENC_B
M0_ENC_Z: J4.2 R12.1 ; port M0_ENC_Z
M1_ENC_A: J6.4 R17.1 ; port M1_ENC_A
M1_ENC_B: J6.3 R16.1 ; port M1_ENC_B
M1_ENC_Z: J6.2 R15.1 ; port M1_ENC_Z
SWCLK: R9.2 ; port SWCLK
SWDIO: R7.1 ; port SWDIO
USB_DN: D5.1(K1) R10.1 USB1.A7(DN1) USB1.B7(DN2)
USB_DP: D4.1(K1) R11.1 USB1.A6(DP1) USB1.B6(DP2)
USB_N: R10.2 ; port USB_N
USB_P: R11.2 ; port USB_P
NetJ2_3: J2.3 R7.2
NetJ2_4: J2.4 R9.1
NetR6_2: R6.2 USB1.A5(CC1)
NetR8_1: R8.1 USB1.B5(CC2)

Not connected (* = marked no-connect by the designer): J2 5* 6*; J3 5* 6*; J4 6* 7*; J5 7* 8*; J6 6* 7*; USB1 A8(SBU1)* B8(SBU2)*

### Buses and harness runs
bus GPIO_[1..5] = port GPIO_[1..5]

### Layout directives
differential pair: USB_N, USB_P

### Notes on the sheet
- USB
- SWD
- CAN_PORT
- ENCODER
- GPIO_PORT
- can connect to MT6701
  Support ABZ or UVW etc..

### Library data of the parts
C25 = Cap: Capacitor; Published: 8-Jun-2000; LatestRevisionDate: 17-Jul-2002; LatestRevisionNote: Re-released for DXP Platform.; PackageReference: RAD-0.3; Publisher: Altium Limited; PackageDescription: Radial Cap, Thru-Hole; 2 Leads; 0.3 in Pin Spacing
D2 = Diode_Schottky: as D3 on sheet AuxHalfH; Name: B340A-13-F; Symbol: B340A-13-F; Device: B340A-13-F; LCSC Part Name: 40V 3A 500mV@3A; Supplier Part: C85098; Manufacturer Part: B340A-13-F; Supplier Footprint: SMA(DO-214AC); JLCPCB Part Class: 扩展库; Datasheet: https://atta.szlcsc.com/upload/public/pdf/source/20171023/C134454_15087453575121052549.pdf; Supplier: LCSC; Convert to PCB: yes; Forward Voltage (Vf@If): 500mV@3A
D4 D5 = PESD5V0F1BL,315: Diode ESD (Bi-directional); Manufacturer_Name: Nexperia; Datasheet Link: https://assets.nexperia.com/documents/data-sheet/PESD5V0F1BL.pdf; Height: 0mm; Manufacturer_Part_Number: PESD5V0F1BL,315; Mouser Part Number: 771-PESD5V0F1BL315; Mouser Price/Stock: https://www.mouser.co.uk/ProductDetail/Nexperia/PESD5V0F1BL315?qs=GcY6OjH1zdnPNi4NEDIXZQ%3D%3D; Arrow Part Number: PESD5V0F1BL,315; Arrow Price/Stock: https://www.arrow.com/en/products/pesd5v0f1bl315/nexperia?region=nac
J2 = SH1.0-4P: CONN-SMD_4P-P1.25_532610571-2; Manufacturer: BOOMELE(博穆精密); Name: GH1.25-5PLTPZ; Add into BOM: yes; Symbol: GH1.25-5PLTPZ; Device: GH1.25-5PLTPZ; LCSC Part Name: GH1.25-5P立贴编带加盖; Supplier Part: C2829263; Manufacturer Part: GH1.25-5PLTPZ; Supplier Footprint: -; JLCPCB Part Class: Extended Part; Datasheet: https://atta.szlcsc.com/upload/public/pdf/source/20211125/08A09A4909F58AF780B71FE423A00F7E.pdf; Supplier: LCSC; Convert to PCB: yes
J3 = GH1.25-4P: Manufacturer: BOOMELE(博穆精密); Name: GH1.25-5PLTPZ; Add into BOM: yes; Symbol: GH1.25-5PLTPZ; Device: GH1.25-5PLTPZ; LCSC Part Name: GH1.25-5P立贴编带加盖; Supplier Part: C2829263; Manufacturer Part: GH1.25-5PLTPZ; Supplier Footprint: -; JLCPCB Part Class: Extended Part; Datasheet: https://atta.szlcsc.com/upload/public/pdf/source/20211125/08A09A4909F58AF780B71FE423A00F7E.pdf; Supplier: LCSC; Convert to PCB: yes
J4 J6 = GH1.25-5P: Manufacturer: BOOMELE(博穆精密); Name: GH1.25-5PLTPZ; Add into BOM: yes; Symbol: GH1.25-5PLTPZ; Device: GH1.25-5PLTPZ; LCSC Part Name: GH1.25-5P立贴编带加盖; Supplier Part: C2829263; Manufacturer Part: GH1.25-5PLTPZ; Supplier Footprint: -; JLCPCB Part Class: Extended Part; Datasheet: https://atta.szlcsc.com/upload/public/pdf/source/20211125/08A09A4909F58AF780B71FE423A00F7E.pdf; Supplier: LCSC; Convert to PCB: yes
J5 = GH1.25-6P: Manufacturer: BOOMELE(博穆精密); Name: GH1.25-5PLTPZ; Add into BOM: yes; Symbol: GH1.25-5PLTPZ; Device: GH1.25-5PLTPZ; LCSC Part Name: GH1.25-5P立贴编带加盖; Supplier Part: C2829263; Manufacturer Part: GH1.25-5PLTPZ; Supplier Footprint: -; JLCPCB Part Class: Extended Part; Datasheet: https://atta.szlcsc.com/upload/public/pdf/source/20211125/08A09A4909F58AF780B71FE423A00F7E.pdf; Supplier: LCSC; Convert to PCB: yes
R6-R9 = Res: Resistor; Published: 8-Jun-2000; LatestRevisionDate: 17-Jul-2002; LatestRevisionNote: Re-released for DXP Platform.; PackageReference: AXIAL-0.3; Publisher: Altium Limited; PackageDescription: Axial Device, Thru-Hole; 2 Leads; 0.3 in Pin Spacing
R10 R11 = Res: 0402WGF220JTCE; Published: 8-Jun-2000; LatestRevisionDate: 17-Jul-2002; LatestRevisionNote: Re-released for DXP Platform.; PackageReference: AXIAL-0.3; Publisher: Altium Limited; PackageDescription: Axial Device, Thru-Hole; 2 Leads; 0.3 in Pin Spacing
R12-R17 = Res: Published: 8-Jun-2000; LatestRevisionDate: 17-Jul-2002; LatestRevisionNote: Re-released for DXP Platform.; PackageReference: AXIAL-0.3; Publisher: Altium Limited; PackageDescription: Axial Device, Thru-Hole; 2 Leads; 0.3 in Pin Spacing

## Sheet CAN.SchDoc
size A4
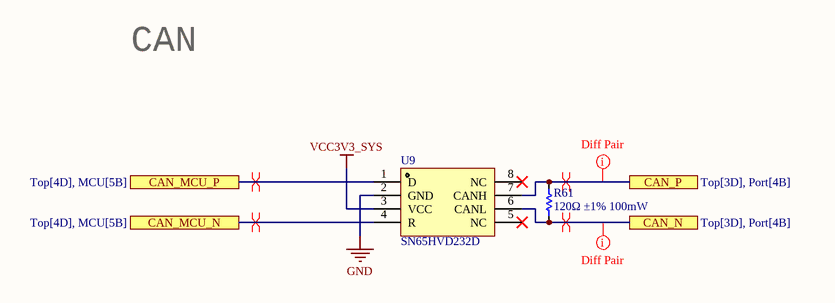
[diagram p7: CAN.SchDoc]

### Parts
R61  120Ω ±1% 100mW  [R0603]
U9  SN65HVD232D  [SOIC127P600X175-8N]

### Ports
CAN_MCU_N (see Top[4D], MCU[5B]), CAN_MCU_P (see Top[4D], MCU[5B]), CAN_N (see Top[3D], Port[4B]), CAN_P (see Top[3D], Port[4B])

### Nets
GND: U9.2(GND)
VCC3V3_SYS: U9.3(VCC)
CAN_MCU_N: U9.4(R) ; port CAN_MCU_N
CAN_MCU_P: U9.1(D) ; port CAN_MCU_P
CAN_N: R61.1 U9.6(CANL) ; port CAN_N
CAN_P: R61.2 U9.7(CANH) ; port CAN_P

Not connected (* = marked no-connect by the designer): U9 5(NC)* 8(NC)*

### Layout directives
differential pair: CAN_MCU_N, CAN_MCU_P, CAN_N, CAN_P
mark named Diff Pair: CAN_N, CAN_P

### Notes on the sheet
- CAN

### Library data of the parts
R61 = Res: Resistor; Published: 8-Jun-2000; LatestRevisionDate: 17-Jul-2002; LatestRevisionNote: Re-released for DXP Platform.; PackageReference: AXIAL-0.3; Publisher: Altium Limited; PackageDescription: Axial Device, Thru-Hole; 2 Leads; 0.3 in Pin Spacing
U9 = SN65HVD232D: Manufacturer: Texas Instruments; Protocol: CAN; Number of Drivers/Receivers: 1/1; Duplex: Half; Data Rate: 1Mbps; Voltage - Supply: 3 V ~ 3.6 V; Supplier 1: Digi-Key; Supplier Part Number 1: 296-26344-2-ND; RoHS: RoHS Compliant; Category: Integrated Circuits (ICs); Stock: 5000; Pricing 1: 2500=0.84375 (USD); Packaging: Tape & Reel (TR); Part Status: Active; Type: Transceiver; Operating Temperature: -40°C ~ 85°C; Mounting Type: Surface Mount; Package / Case: 8-SOIC (0.154", 3.90mm Width); Supplier Device Package: 8-SOIC; ComponentLink1URL: http://www.ti.com/lit/ds/symlink/sn65hvd230.pdf; ComponentLink1Description: http://www.ti.com/lit/ds/symlink/sn65hvd230.pdf; Supplier 2: Digi-Key; Supplier Part Number 2: 296-26344-1-ND; Pricing 2: 1=2.05, 10=1.842, 100=1.4809, 500=1.21668, 1000=1.00811 (USD)

## Sheet Others.SchDoc
size A4
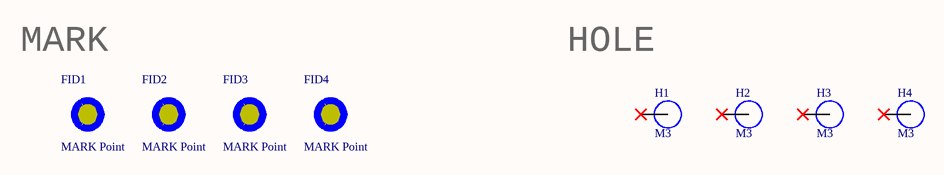
[diagram p8: Others.SchDoc]

### Parts
FID1  MARK Point  [FIDUCIAL]
FID2  MARK Point  [FIDUCIAL]
FID3  MARK Point  [FIDUCIAL]
FID4  MARK Point  [FIDUCIAL]
H1  M3  [M3_NPTH]
H2  M3  [M3_NPTH]
H3  M3  [M3_NPTH]
H4  M3  [M3_NPTH]

### Nets

Not connected (* = marked no-connect by the designer): H1 1*; H2 1*; H3 1*; H4 1*

### Notes on the sheet
- MARK
- HOLE

### Library data of the parts
FID1-FID4 = FIDUCIAL: 1mm Fiducial with 2mm soldermask, 3mm keepout
H1-H4 = NPTH: Hole without copper

## Nets that join several sheets
AGND: AuxHalfH (6 pins), MCU (C36.1 U4.12), Motor0 (7 pins), Motor1 (7 pins), Power (C22.1 C24.1 FB2.2 R5.1)
GND: MCU (14 pins), Motor0 (8 pins), Motor1 (8 pins), Power (15 pins), Port (15 pins), CAN (U9.2)
GVDD: AuxHalfH (C69.2 D3.2 U7.1), Motor0 (C40.2 U5.9), Motor1 (C55.2 U6.9)
PGND: AuxHalfH (6 pins), Motor0 (7 pins), Motor1 (7 pins), Power (17 pins)
VCC3V3_ASYS: AuxHalfH (C71.2 RT3.1 U8.6 U8.7), MCU (C36.2 U4.13), Motor0 (RT1.1 U5.20), Motor1 (RT2.1 U6.20), Power (C24.2 U3.5)
VCC3V3_SYS: MCU (10 pins), Motor0 (C38.2 U5.45), Motor1 (C53.2 U6.45), Power (C21.2 U2.5), Port (C25.2 J2.1 J3.3), CAN (U9.3)
VCC5V0_SYS: Power (12 pins), Port (9 pins)
VCC16V8_BAT: AuxHalfH (Q13.D), Motor0 (6 pins), Motor1 (6 pins), Power (20 pins)
AUX_H: AuxHalfH (U7.2), MCU (U4.30)
AUX_I: AuxHalfH (C72.2 R60.1), MCU (U4.21)
AUX_L: AuxHalfH (U7.3), MCU (U4.29)
AUX_TEMP: AuxHalfH (C67.2 R55.2 RT3.2), MCU (U4.24)
CAN_MCU_N: MCU (U4.61), CAN (U9.4)
CAN_MCU_P: MCU (U4.62), CAN (U9.1)
CAN_N: Port (J3.2), CAN (R61.1 U9.6)
CAN_P: Port (J3.1), CAN (R61.2 U9.7)
EN_GATE: MCU (U4.33), Motor0 (U5.12), Motor1 (U6.12)
GPIO_1: MCU (U4.14), Port (J5.1)
GPIO_2: MCU (U4.15), Port (J5.2)
GPIO_3: MCU (U4.16), Port (J5.3)
GPIO_4: MCU (U4.17), Port (J5.4)
GPIO_5: MCU (U4.28), Port (J5.5)
M0_ENC_A: MCU (U4.56), Port (J4.4 R14.1)
M0_ENC_B: MCU (U4.57), Port (J4.3 R13.1)
M0_ENC_Z: MCU (U4.50), Port (J4.2 R12.1)
M0_nCS: MCU (R21.1), Motor0 (U5.4)
M0_TEMP: MCU (U4.25), Motor0 (C37.2 R23.1 RT1.2)
M1_ENC_A: MCU (U4.58), Port (J6.4 R17.1)
M1_ENC_B: MCU (U4.59), Port (J6.3 R16.1)
M1_ENC_Z: MCU (U4.55), Port (J6.2 R15.1)
M1_nCS: MCU (R22.1), Motor1 (U6.4)
M1_TEMP: MCU (U4.20), Motor1 (C52.2 R39.2 RT2.2)
NetC47_2: MCU (U4.8), Motor0 (C47.2 R34.2)
NetC48_2: MCU (U4.9), Motor0 (C48.2 R37.2)
NetC62_2: MCU (U4.11), Motor1 (C62.2 R52.2)
NetC63_2: MCU (U4.10), Motor1 (C63.2 R53.2)
NetU4_4: MCU (U4.4), Motor1 (U6.8)
NetU4_23: MCU (U4.23), Motor1 (U6.14)
NetU4_26: MCU (U4.26), Motor1 (U6.16)
NetU4_27: MCU (U4.27), Motor1 (U6.18)
NetU4_34: MCU (U4.34), Motor0 (U5.14)
NetU4_35: MCU (U4.35), Motor0 (U5.16)
NetU4_36: MCU (U4.36), Motor0 (U5.18)
NetU4_37: MCU (U4.37), Motor1 (U6.13)
NetU4_38: MCU (U4.38), Motor1 (U6.15)
NetU4_39: MCU (U4.39), Motor1 (U6.17)
NetU4_40: MCU (U4.40), Motor0 (U5.8)
NetU4_41: MCU (U4.41), Motor0 (U5.13)
NetU4_42: MCU (U4.42), Motor0 (U5.15)
NetU4_43: MCU (U4.43), Motor0 (U5.17)
nFAULT: MCU (U4.54), Motor0 (R24.1), Motor1 (R40.1)
SPI_MISO: MCU (U4.52), Motor0 (R29.1), Motor1 (R45.1)
SPI_MOSI: MCU (R20.1), Motor0 (U5.5), Motor1 (U6.5)
SPI_SCK: MCU (R19.1), Motor0 (U5.7), Motor1 (U6.7)
SWCLK: MCU (U4.49), Port (R9.2)
SWDIO: MCU (U4.46), Port (R7.1)
USB_N: MCU (U4.44), Port (R10.2)
USB_P: MCU (U4.45), Port (R11.2)
VBUS_S: MCU (U4.22), Power (C22.2 R4.1 R5.2)

## Assembly variants
noCAN: not fitted R61 U9